# Altium project PCB_Project.PrjPcb
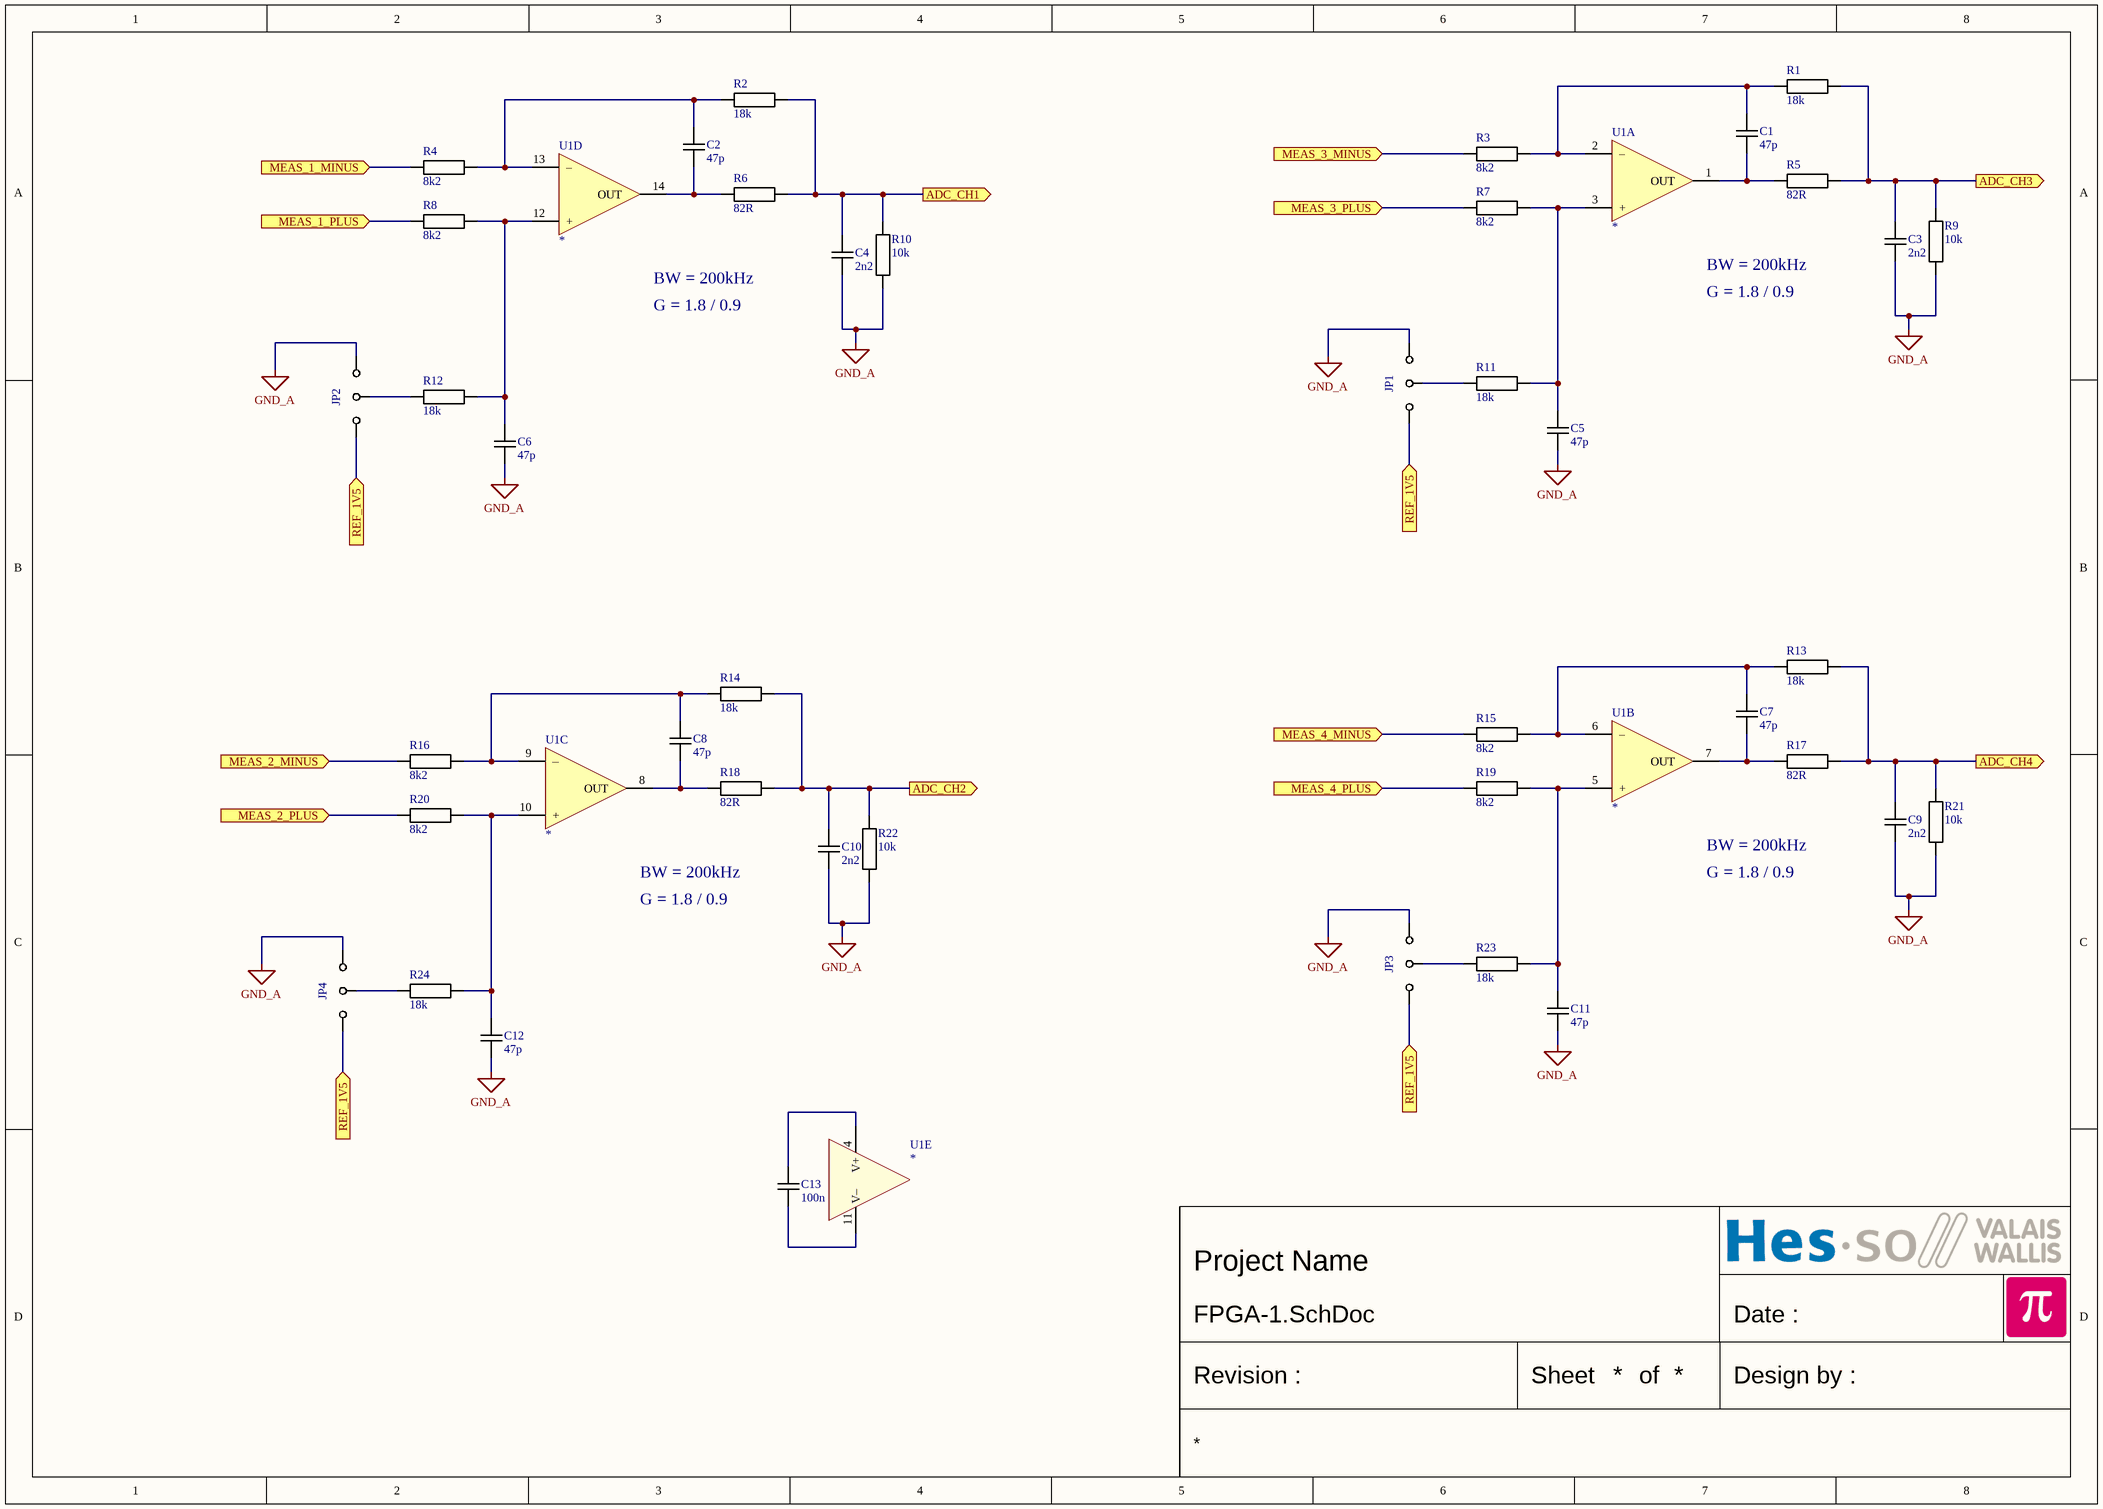
[diagram p0: FPGA-1.SchDoc]
7 sheets, 224 parts. Net scope: flat (ports and power ports of the same name join across sheets).
Board file: PCB-FPGA.PcbDoc
Sheets:
  FPGA-1.SchDoc
  FPGA.SchDoc
  FPGA-8.SchDoc
  FPGA-2.SchDoc
  FPGA-3.SchDoc
  FPGA-7.SchDoc
  FPGA-Supply.SchDoc

## Sheet FPGA-1.SchDoc
size A3; Date: Date; CompanyName: HESSO; Engineer: Name; Address1: Route du Rawyl 47; Address2: 1950 Sion; Address3: Switzerland; ProjectName: Project Name

### Parts
C1  47p  [CAPACITOR 1608 REFLOW]
C2  47p  [CAPACITOR 1608 REFLOW]
C3  2n2  [CAPACITOR 1608 REFLOW]
C4  2n2  [CAPACITOR 1608 REFLOW]
C5  47p  [CAPACITOR 1608 REFLOW]
C6  47p  [CAPACITOR 1608 REFLOW]
C7  47p  [CAPACITOR 1608 REFLOW]
C8  47p  [CAPACITOR 1608 REFLOW]
C9  2n2  [CAPACITOR 1608 REFLOW]
C10  2n2  [CAPACITOR 1608 REFLOW]
C11  47p  [CAPACITOR 1608 REFLOW]
C12  47p  [CAPACITOR 1608 REFLOW]
C13  100n  [CAPACITOR 1608 REFLOW]
JP1  {Value}  [JUMPER3 SMD 1608]  (value not drawn)
JP2  {Value}  [JUMPER3 SMD 1608]  (value not drawn)
JP3  {Value}  [JUMPER3 SMD 1608]  (value not drawn)
JP4  {Value}  [JUMPER3 SMD 1608]  (value not drawn)
R1  18k  [RESISTOR 1608 REFLOW]
R2  18k  [RESISTOR 1608 REFLOW]
R3  8k2  [RESISTOR 1608 REFLOW]
R4  8k2  [RESISTOR 1608 REFLOW]
R5  82R  [RESISTOR 1608 REFLOW]
R6  82R  [RESISTOR 1608 REFLOW]
R7  8k2  [RESISTOR 1608 REFLOW]
R8  8k2  [RESISTOR 1608 REFLOW]
R9  10k  [RESISTOR 1608 REFLOW]
R10  10k  [RESISTOR 1608 REFLOW]
R11  18k  [RESISTOR 1608 REFLOW]
R12  18k  [RESISTOR 1608 REFLOW]
R13  18k  [RESISTOR 1608 REFLOW]
R14  18k  [RESISTOR 1608 REFLOW]
R15  8k2  [RESISTOR 1608 REFLOW]
R16  8k2  [RESISTOR 1608 REFLOW]
R17  82R  [RESISTOR 1608 REFLOW]
R18  82R  [RESISTOR 1608 REFLOW]
R19  8k2  [RESISTOR 1608 REFLOW]
R20  8k2  [RESISTOR 1608 REFLOW]
R21  10k  [RESISTOR 1608 REFLOW]
R22  10k  [RESISTOR 1608 REFLOW]
R23  18k  [RESISTOR 1608 REFLOW]
R24  18k  [RESISTOR 1608 REFLOW]
U1  *  [SO14 P1.27 C4.0X8.8 H1.75]  (parts A,B,C,D,E of 5)

### Ports
ADC_CH1 (out), ADC_CH2 (out), ADC_CH3 (out), ADC_CH4 (out), MEAS_1_MINUS (in), MEAS_1_PLUS (in), MEAS_2_MINUS (in), MEAS_2_PLUS (in), MEAS_3_MINUS (in), MEAS_3_PLUS (in), MEAS_4_MINUS (in), MEAS_4_PLUS (in), REF_1V5 (in)

### Nets
GND_A: C3.1 C4.1 C5.1 C6.1 C9.1 C10.1 C11.1 C12.1 JP1.3 JP2.3 JP3.3 JP4.3 R9.2 R10.2 R21.2 R22.2
NetC1_1: C1.1 R5.1 U1.1(OUT)
NetC1_2: C1.2 R1.1 R3.2 U1.2(–)
NetC2_1: C2.1 R6.1 U1.14(OUT)
NetC2_2: C2.2 R2.1 R4.2 U1.13(–)
NetC3_2: C3.2 R1.2 R5.2 R9.1 ; port ADC_CH3
NetC4_2: C4.2 R2.2 R6.2 R10.1 ; port ADC_CH1
NetC5_2: C5.2 R7.2 R11.1 U1.3(+)
NetC6_2: C6.2 R8.2 R12.1 U1.12(+)
NetC7_1: C7.1 R17.1 U1.7(OUT)
NetC7_2: C7.2 R13.1 R15.2 U1.6(–)
NetC8_1: C8.1 R18.1 U1.8(OUT)
NetC8_2: C8.2 R14.1 R16.2 U1.9(–)
NetC9_2: C9.2 R13.2 R17.2 R21.1 ; port ADC_CH4
NetC10_2: C10.2 R14.2 R18.2 R22.1 ; port ADC_CH2
NetC11_2: C11.2 R19.2 R23.1 U1.5(+)
NetC12_2: C12.2 R20.2 R24.1 U1.10(+)
NetC13_1: C13.1 U1.11(V–)
NetC13_2: C13.2 U1.4(V+)
NetC106_2: JP1.1 JP2.1 JP3.1 JP4.1 ; port REF_1V5
NetJP1_2: JP1.2 R11.2
NetJP2_2: JP2.2 R12.2
NetJP3_2: JP3.2 R23.2
NetJP4_2: JP4.2 R24.2
NetR3_1: R3.1 ; port MEAS_3_MINUS
NetR4_1: R4.1 ; port MEAS_1_MINUS
NetR7_1: R7.1 ; port MEAS_3_PLUS
NetR8_1: R8.1 ; port MEAS_1_PLUS
NetR15_1: R15.1 ; port MEAS_4_MINUS
NetR16_1: R16.1 ; port MEAS_2_MINUS
NetR19_1: R19.1 ; port MEAS_4_PLUS
NetR20_1: R20.1 ; port MEAS_2_PLUS

### Notes on the sheet
- BW = 200kHz
- G = 1.8 / 0.9
- Date :
- Revision :
- Sheet
- of
- Design by :

### Library data of the parts
C1-C13 = Capacitor: Capacitor X7R 10% 50V 1608(0603)
  C1 C2 C5-C8 C11 C12: Value: 47p
  C3 C4 C9 C10: Value: 2n2
  C13: Value: 100n
JP1-JP4 = JUMPER 3 POS: Value: {Value}
R1-R24 = Resistor: Resistor 1% 50V 100mW 1608(0603)
  R1 R2 R11-R14 R23 R24: Value: 18k
  R3 R4 R7 R8 R15 R16 R19 R20: Value: 8k2
  R5 R6 R17 R18: Value: 82R
  R9 R10 R21 R22: Value: 10k
U1 = OPA QUAD: Generic quad OPA 14 pins; Value: *

## Sheet FPGA.SchDoc
size A2; Date: Date; CompanyName: HESSO; Engineer: Name; Address1: Route du Rawyl 47; Address2: 1950 Sion; Address3: Switzerland; ProjectName: Project Name
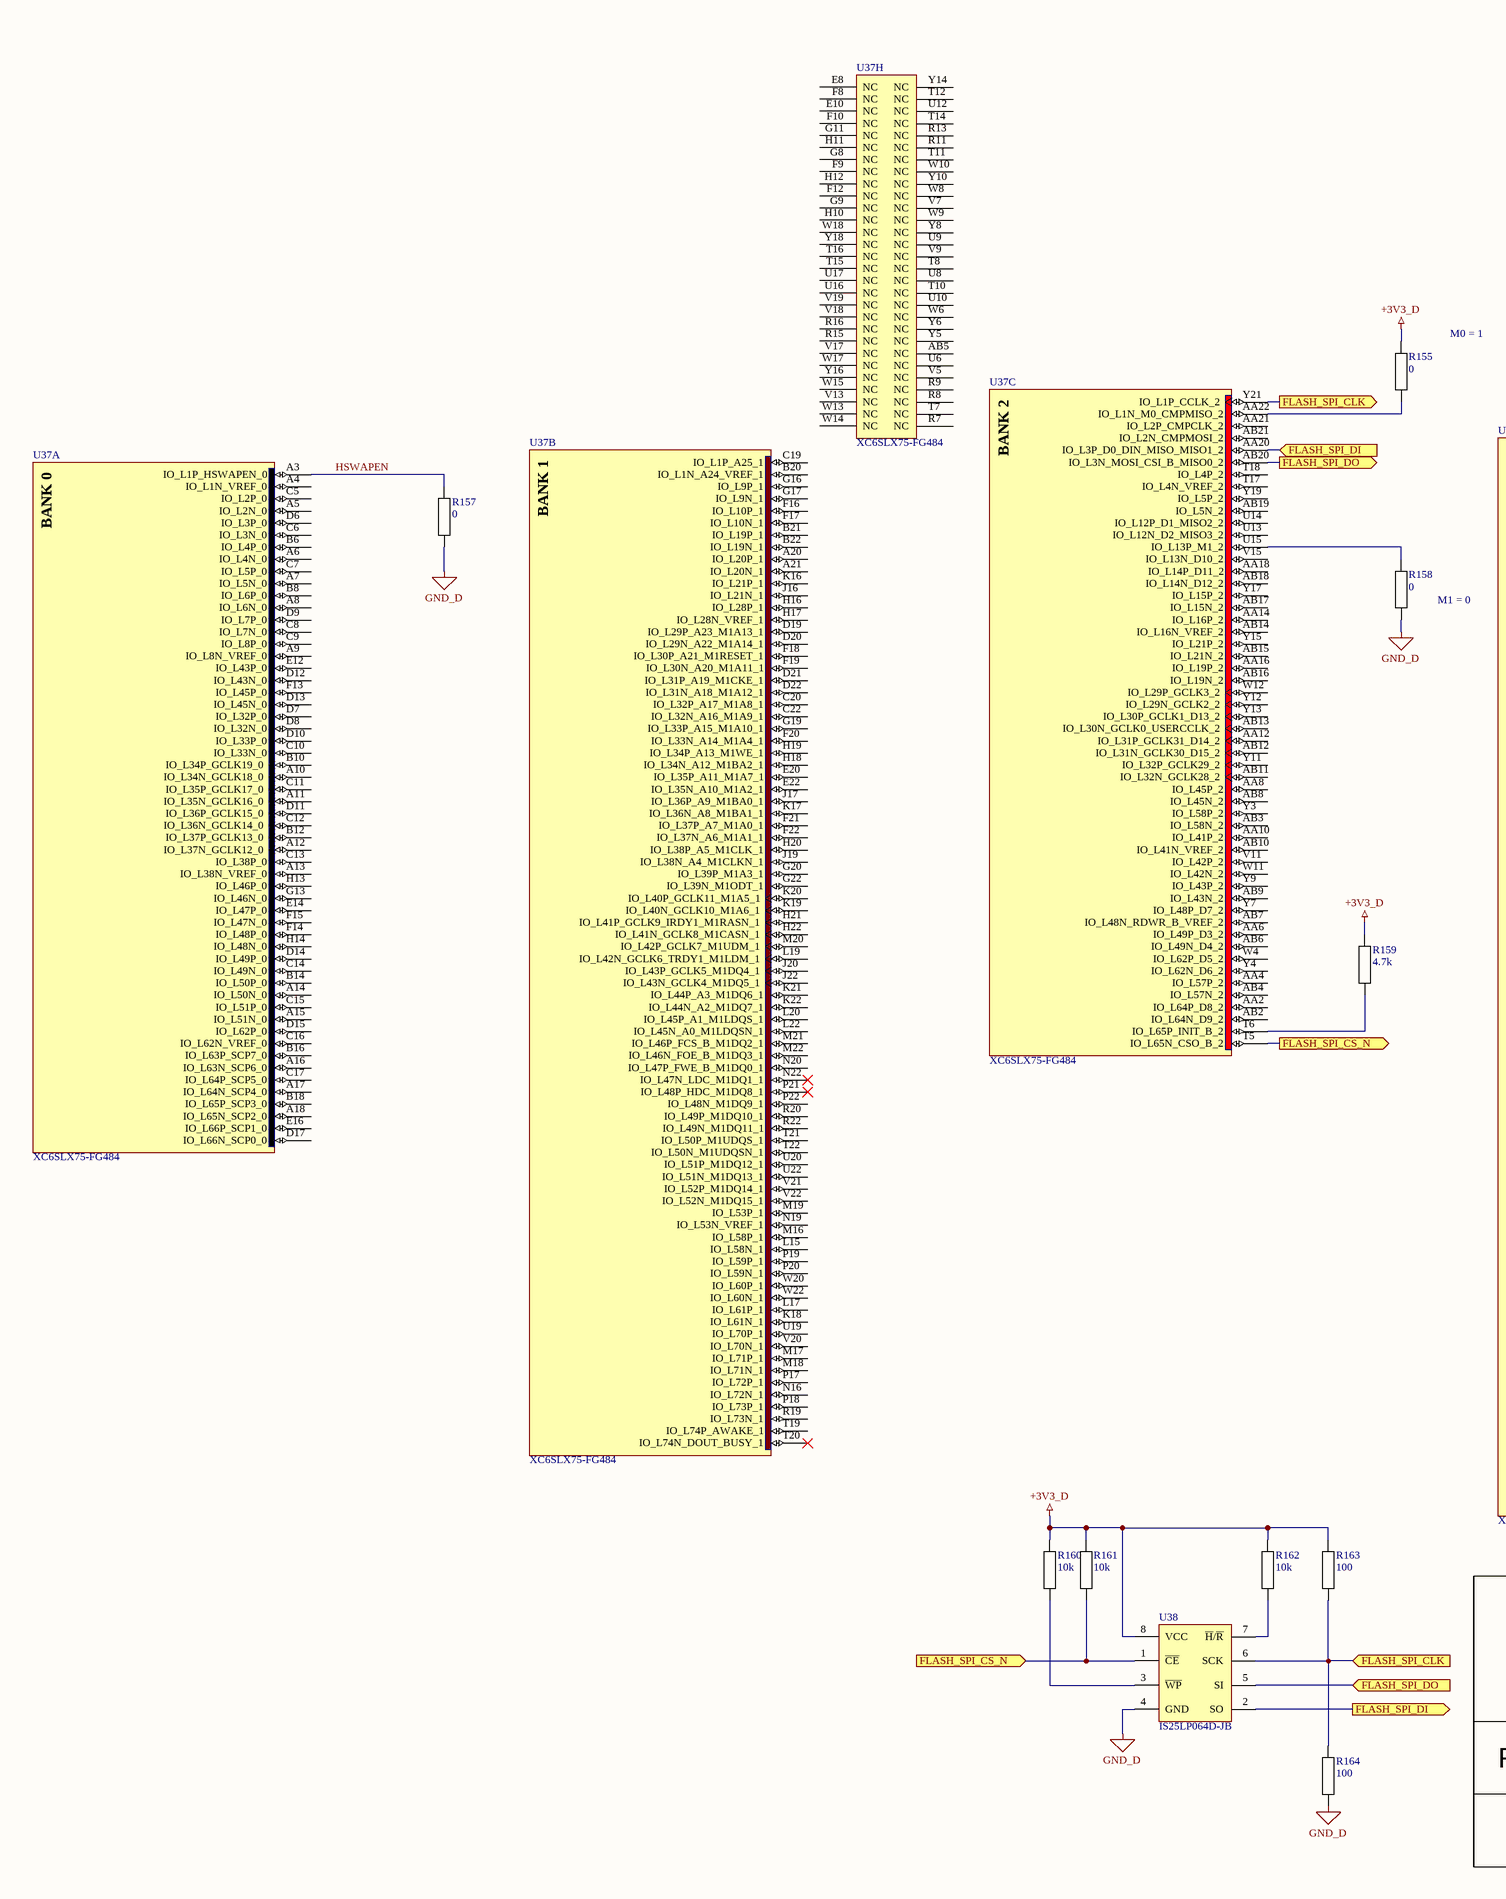
[diagram p1: FPGA.SchDoc, left]
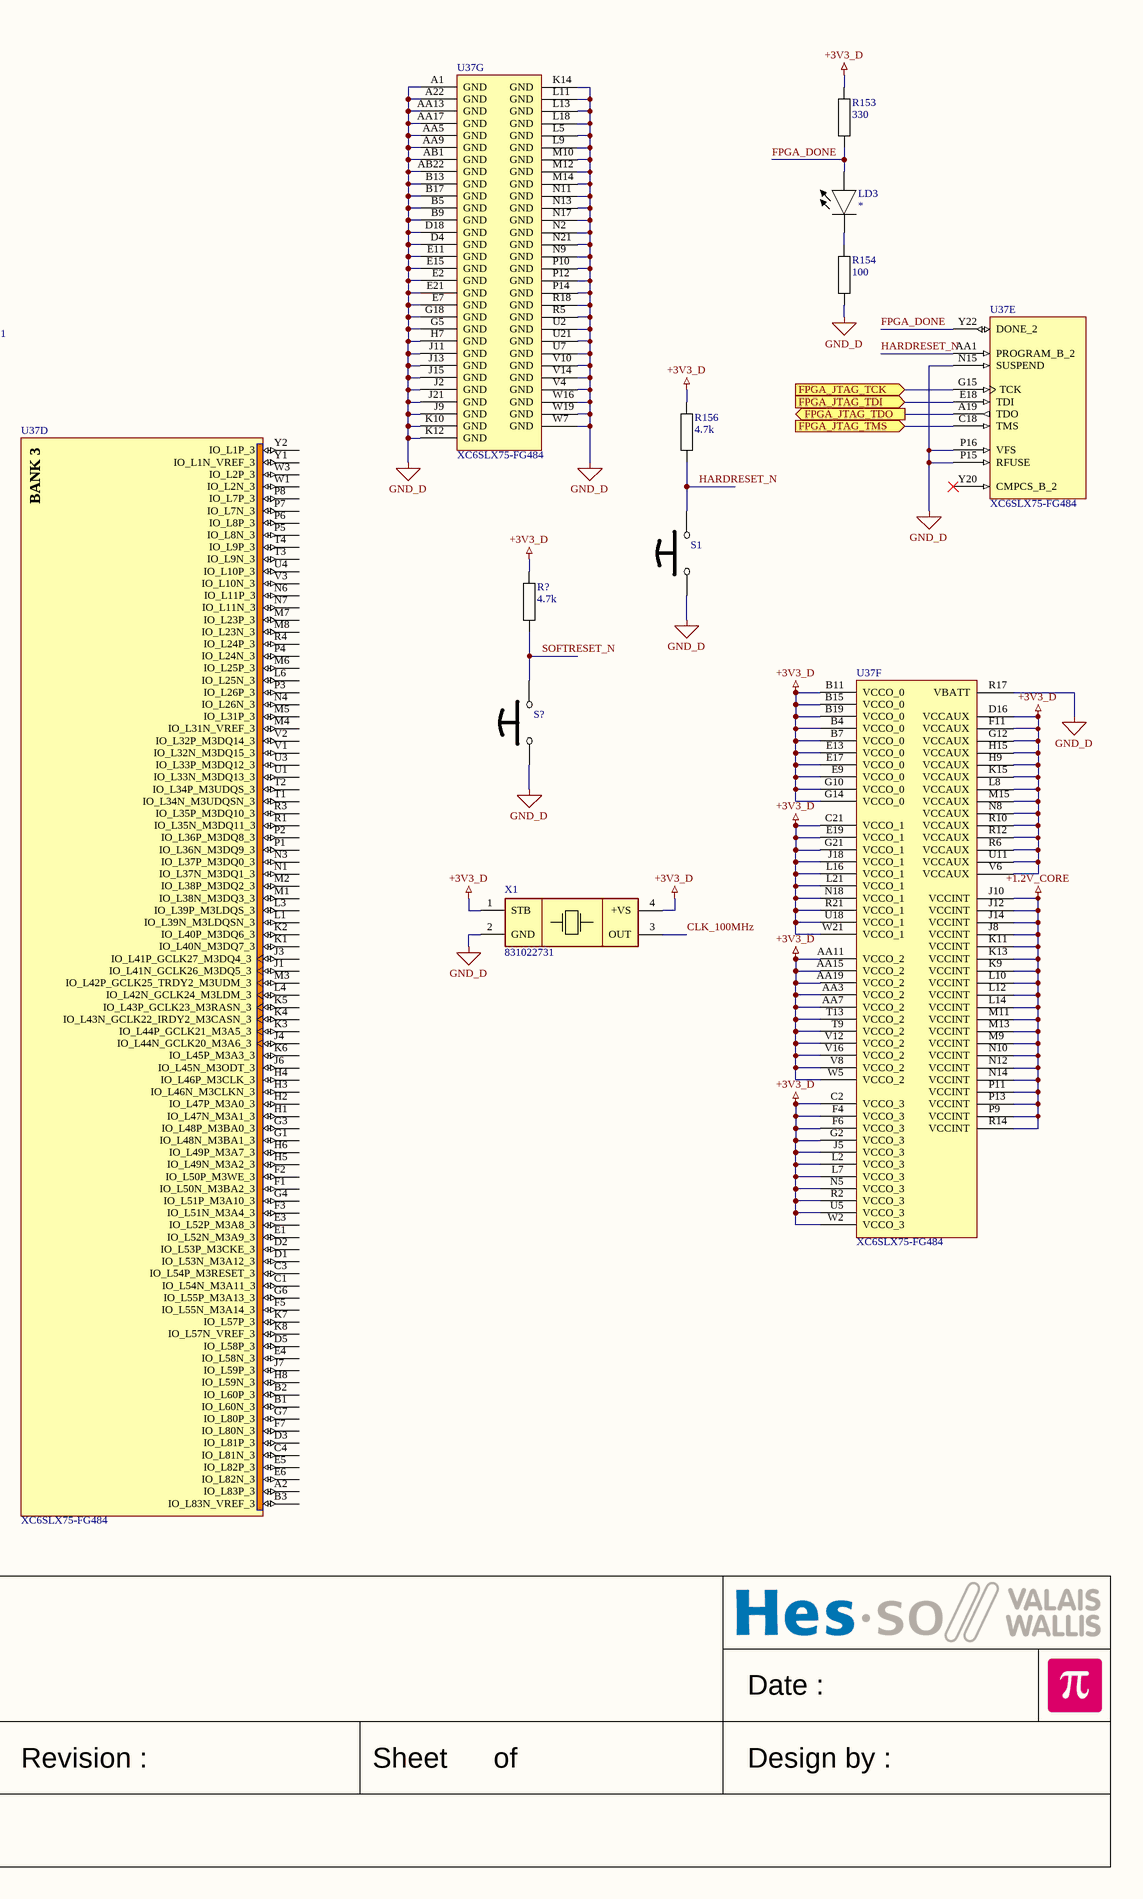
[diagram p2: FPGA.SchDoc, right]

### Parts
LD3  *  [LED 1608 REFLOW]
R153  330  [RESISTOR 2012 REFLOW]
R154  100  [RESISTOR 2012 REFLOW]
R155  0  [RESISTOR 2012 REFLOW]
R156  4.7k  [RESISTOR 2012 REFLOW]
R157  0  [RESISTOR 2012 REFLOW]
R158  0  [RESISTOR 2012 REFLOW]
R159  4.7k  [RESISTOR 2012 REFLOW]
R160  10k  [RESISTOR 1608 REFLOW]
R161  10k  [RESISTOR 1608 REFLOW]
R162  10k  [RESISTOR 1608 REFLOW]
R163  100  [RESISTOR 1608 REFLOW]
R164  100  [RESISTOR 1608 REFLOW]
R?  4.7k  [RESISTOR 2012 REFLOW]
S1  *  [Push Button C2.5X3.0 OMRON B3U-1000P(M)-B]  (value not drawn)
S?  *  [Push Button C2.5X3.0 OMRON B3U-1000P(M)-B]  (value not drawn)
U37  XC6SLX75-FG484  [BGA484 P1.0 C23X23 H2.2]  (parts A,B,C,D,E,F,G,H of 8)
U38  IS25LP064D-JB  [SO8 P1.27 C4.0X5.0 H1.75]
X1  831022731  [Oscillator C5.2x7.2 IQD LFSPXO]

### Ports
FLASH_SPI_CLK (in), FLASH_SPI_CLK (out), FLASH_SPI_CS_N (in), FLASH_SPI_CS_N (out), FLASH_SPI_DI (in), FLASH_SPI_DI (out), FLASH_SPI_DO (in), FLASH_SPI_DO (out), FPGA_JTAG_TCK (in), FPGA_JTAG_TDI (in), FPGA_JTAG_TDO (out), FPGA_JTAG_TMS (in)

### Nets
+1.2V_CORE: U37.J8(VCCINT) U37.J10(VCCINT) U37.J12(VCCINT) U37.J14(VCCINT) U37.K9(VCCINT) U37.K11(VCCINT) U37.K13(VCCINT) U37.L10(VCCINT) U37.L12(VCCINT) U37.L14(VCCINT) U37.M9(VCCINT) U37.M11(VCCINT) U37.M13(VCCINT) U37.N10(VCCINT) U37.N12(VCCINT) U37.N14(VCCINT) U37.P9(VCCINT) U37.P11(VCCINT) U37.P13(VCCINT) U37.R14(VCCINT)
+3V3_D: R153.2 R155.2 R156.2 R159.2 R160.2 R161.2 R162.2 R163.2 R?.2 U37.AA3(VCCO_2) U37.AA7(VCCO_2) U37.AA11(VCCO_2) U37.AA15(VCCO_2) U37.AA19(VCCO_2) U37.B4(VCCO_0) U37.B7(VCCO_0) U37.B11(VCCO_0) U37.B15(VCCO_0) U37.B19(VCCO_0) U37.C2(VCCO_3) U37.C21(VCCO_1) U37.D16(VCCAUX) U37.E9(VCCO_0) U37.E13(VCCO_0) U37.E17(VCCO_0) U37.E19(VCCO_1) U37.F4(VCCO_3) U37.F6(VCCO_3) U37.F11(VCCAUX) U37.G2(VCCO_3) U37.G10(VCCO_0) U37.G12(VCCAUX) U37.G14(VCCO_0) U37.G21(VCCO_1) U37.H9(VCCAUX) U37.H15(VCCAUX) U37.J5(VCCO_3) U37.J18(VCCO_1) U37.K15(VCCAUX) U37.L2(VCCO_3) U37.L7(VCCO_3) U37.L8(VCCAUX) U37.L16(VCCO_1) U37.L21(VCCO_1) U37.M15(VCCAUX) U37.N5(VCCO_3) U37.N8(VCCAUX) U37.N18(VCCO_1) U37.R2(VCCO_3) U37.R6(VCCAUX) U37.R10(VCCAUX) U37.R12(VCCAUX) U37.R21(VCCO_1) U37.T9(VCCO_2) U37.T13(VCCO_2) U37.U5(VCCO_3) U37.U11(VCCAUX) U37.U18(VCCO_1) U37.V6(VCCAUX) U37.V8(VCCO_2) U37.V12(VCCO_2) U37.V16(VCCO_2) U37.W2(VCCO_3) U37.W5(VCCO_2) U37.W21(VCCO_1) U38.8(VCC) X1.1(STB) X1.4(+VS)
GND_D: R154.1 R157.1 R158.1 R164.1 S1.1 S?.1 U37.A1(GND) U37.A22(GND) U37.AA5(GND) U37.AA9(GND) U37.AA13(GND) U37.AA17(GND) U37.AB1(GND) U37.AB22(GND) U37.B5(GND) U37.B9(GND) U37.B13(GND) U37.B17(GND) U37.D4(GND) U37.D18(GND) U37.E2(GND) U37.E7(GND) U37.E11(GND) U37.E15(GND) U37.E21(GND) U37.G5(GND) U37.G18(GND) U37.H7(GND) U37.J2(GND) U37.J9(GND) U37.J11(GND) U37.J13(GND) U37.J15(GND) U37.J21(GND) U37.K10(GND) U37.K12(GND) U37.K14(GND) U37.L5(GND) U37.L9(GND) U37.L11(GND) U37.L13(GND) U37.L18(GND) U37.M10(GND) U37.M12(GND) U37.M14(GND) U37.N2(GND) U37.N9(GND) U37.N11(GND) U37.N13(GND) U37.N15(SUSPEND) U37.N17(GND) U37.N21(GND) U37.P10(GND) U37.P12(GND) U37.P14(GND) U37.P15(RFUSE) U37.P16(VFS) U37.R5(GND) U37.R17(VBATT) U37.R18(GND) U37.U2(GND) U37.U7(GND) U37.U21(GND) U37.V4(GND) U37.V10(GND) U37.V14(GND) U37.W7(GND) U37.W16(GND) U37.W19(GND) U38.4(GND) X1.2(GND)
CLK_100MHz: X1.3(OUT)
FPGA_DONE: LD3.2(A) R153.1 U37.Y22(DONE_2)
HARDRESET_N: R156.1 S1.2 U37.AA1(PROGRAM_B_2)
HSWAPEN: R157.2 U37.A3(IO_L1P_HSWAPEN_0)
SOFTRESET_N: R?.1 S?.2
NetLD3_1: LD3.1(C) R154.2
NetR155_1: R155.1 U37.AA22(IO_L1N_M0_CMPMISO_2)
NetR158_2: R158.2 U37.U15(IO_L13P_M1_2)
NetR159_1: R159.1 U37.T6(IO_L65P_INIT_B_2)
NetR160_1: R160.1 U38.3(~{WP})
NetR161_1: R161.1 U37.T5(IO_L65N_CSO_B_2) U38.1(~{CE}) ; port FLASH_SPI_CS_N
NetR162_1: R162.1 U38.7(~{H}/~{R})
NetR163_1: R163.1 R164.2 U37.Y21(IO_L1P_CCLK_2) U38.6(SCK) ; port FLASH_SPI_CLK
NetU37_A19: U37.A19(TDO) ; port FPGA_JTAG_TDO
NetU37_AA20: U37.AA20(IO_L3P_D0_DIN_MISO_MISO1_2) U38.2(SO) ; port FLASH_SPI_DI
NetU37_AB20: U37.AB20(IO_L3N_MOSI_CSI_B_MISO0_2) U38.5(SI) ; port FLASH_SPI_DO
NetU37_C18: U37.C18(TMS) ; port FPGA_JTAG_TMS
NetU37_E18: U37.E18(TDI) ; port FPGA_JTAG_TDI
NetU37_G15: U37.G15(TCK) ; port FPGA_JTAG_TCK

Not connected (* = marked no-connect by the designer): U37 A2(IO_L83P_3) A4(IO_L1N_VREF_0) A5(IO_L2N_0) A6(IO_L4N_0) A7(IO_L5N_0) A8(IO_L6N_0) A9(IO_L8N_VREF_0) A10(IO_L34N_GCLK18_0) A11(IO_L35N_GCLK16_0) A12(IO_L37N_GCLK12_0) A13(IO_L38N_VREF_0) A14(IO_L50N_0) A15(IO_L51N_0) A16(IO_L63N_SCP6_0) A17(IO_L64N_SCP4_0) A18(IO_L65N_SCP2_0) A20(IO_L20P_1) A21(IO_L20N_1) AA2(IO_L64P_D8_2) AA4(IO_L57P_2) AA6(IO_L49P_D3_2) AA8(IO_L45P_2) AA10(IO_L41P_2) AA12(IO_L31P_GCLK31_D14_2) AA14(IO_L16P_2) AA16(IO_L19P_2) AA18(IO_L14P_D11_2) AA21(IO_L2P_CMPCLK_2) AB2(IO_L64N_D9_2) AB3(IO_L58N_2) AB4(IO_L57N_2) AB5(NC) AB6(IO_L49N_D4_2) AB7(IO_L48N_RDWR_B_VREF_2) AB8(IO_L45N_2) AB9(IO_L43N_2) AB10(IO_L41N_VREF_2) AB11(IO_L32N_GCLK28_2) AB12(IO_L31N_GCLK30_D15_2) AB13(IO_L30N_GCLK0_USERCCLK_2) AB14(IO_L16N_VREF_2) AB15(IO_L21N_2) AB16(IO_L19N_2) AB17(IO_L15N_2) AB18(IO_L14N_D12_2) AB19(IO_L5N_2) AB21(IO_L2N_CMPMOSI_2) B1(IO_L60N_3) B2(IO_L60P_3) B3(IO_L83N_VREF_3) B6(IO_L4P_0) B8(IO_L6P_0) B10(IO_L34P_GCLK19_0) B12(IO_L37P_GCLK13_0) B14(IO_L50P_0) B16(IO_L63P_SCP7_0) B18(IO_L65P_SCP3_0) B20(IO_L1N_A24_VREF_1) B21(IO_L19P_1) B22(IO_L19N_1) C1(IO_L54N_M3A11_3) C3(IO_L54P_M3RESET_3) C4(IO_L81N_3) C5(IO_L2P_0) C6(IO_L3N_0) C7(IO_L5P_0) C8(IO_L7N_0) C9(IO_L8P_0) C10(IO_L33N_0) C11(IO_L35P_GCLK17_0) C12(IO_L36N_GCLK14_0) C13(IO_L38P_0) C14(IO_L49N_0) C15(IO_L51P_0) C16(IO_L62N_VREF_0) C17(IO_L64P_SCP5_0) C19(IO_L1P_A25_1) C20(IO_L32P_A17_M1A8_1) C22(IO_L32N_A16_M1A9_1) D1(IO_L53N_M3A12_3) D2(IO_L53P_M3CKE_3) D3(IO_L81P_3) D5(IO_L58P_3) D6(IO_L3P_0) D7(IO_L32P_0) D8(IO_L32N_0) D9(IO_L7P_0) D10(IO_L33P_0) D11(IO_L36P_GCLK15_0) D12(IO_L43N_0) D13(IO_L45N_0) D14(IO_L49P_0) D15(IO_L62P_0) D17(IO_L66N_SCP0_0) D19(IO_L29P_A23_M1A13_1) D20(IO_L29N_A22_M1A14_1) D21(IO_L31P_A19_M1CKE_1) D22(IO_L31N_A18_M1A12_1) E1(IO_L52N_M3A9_3) E3(IO_L52P_M3A8_3) E4(IO_L58N_3) E5(IO_L82P_3) E6(IO_L82N_3) E8(NC) E10(NC) E12(IO_L43P_0) E14(IO_L47P_0) E16(IO_L66P_SCP1_0) E20(IO_L35P_A11_M1A7_1) E22(IO_L35N_A10_M1A2_1) F1(IO_L50N_M3BA2_3) F2(IO_L50P_M3WE_3) F3(IO_L51N_M3A4_3) F5(IO_L55N_M3A14_3) F7(IO_L80N_3) F8(NC) F9(NC) F10(NC) F12(NC) F13(IO_L45P_0) F14(IO_L48P_0) F15(IO_L47N_0) F16(IO_L10P_1) F17(IO_L10N_1) F18(IO_L30P_A21_M1RESET_1) F19(IO_L30N_A20_M1A11_1) F20(IO_L33N_A14_M1A4_1) F21(IO_L37P_A7_M1A0_1) F22(IO_L37N_A6_M1A1_1) G1(IO_L48N_M3BA1_3) G3(IO_L48P_M3BA0_3) G4(IO_L51P_M3A10_3) G6(IO_L55P_M3A13_3) G7(IO_L80P_3) G8(NC) G9(NC) G11(NC) G13(IO_L46N_0) G16(IO_L9P_1) G17(IO_L9N_1) G19(IO_L33P_A15_M1A10_1) G20(IO_L39P_M1A3_1) G22(IO_L39N_M1ODT_1) H1(IO_L47N_M3A1_3) H2(IO_L47P_M3A0_3) H3(IO_L46N_M3CLKN_3) H4(IO_L46P_M3CLK_3) H5(IO_L49N_M3A2_3) H6(IO_L49P_M3A7_3) H8(IO_L59N_3) H10(NC) H11(NC) H12(NC) H13(IO_L46P_0) H14(IO_L48N_0) H16(IO_L28P_1) H17(IO_L28N_VREF_1) H18(IO_L34N_A12_M1BA2_1) H19(IO_L34P_A13_M1WE_1) H20(IO_L38P_A5_M1CLK_1) H21(IO_L41P_GCLK9_IRDY1_M1RASN_1) H22(IO_L41N_GCLK8_M1CASN_1) J1(IO_L41N_GCLK26_M3DQ5_3) J3(IO_L41P_GCLK27_M3DQ4_3) J4(IO_L44N_GCLK20_M3A6_3) J6(IO_L45N_M3ODT_3) J7(IO_L59P_3) J16(IO_L21N_1) J17(IO_L36P_A9_M1BA0_1) J19(IO_L38N_A4_M1CLKN_1) J20(IO_L43P_GCLK5_M1DQ4_1) J22(IO_L43N_GCLK4_M1DQ5_1) K1(IO_L40N_M3DQ7_3) K2(IO_L40P_M3DQ6_3) K3(IO_L44P_GCLK21_M3A5_3) K4(IO_L43N_GCLK22_IRDY2_M3CASN_3) K5(IO_L43P_GCLK23_M3RASN_3) K6(IO_L45P_M3A3_3) K7(IO_L57P_3) K8(IO_L57N_VREF_3) K16(IO_L21P_1) K17(IO_L36N_A8_M1BA1_1) K18(IO_L61N_1) K19(IO_L40N_GCLK10_M1A6_1) K20(IO_L40P_GCLK11_M1A5_1) K21(IO_L44P_A3_M1DQ6_1) K22(IO_L44N_A2_M1DQ7_1) L1(IO_L39N_M3LDQSN_3) L3(IO_L39P_M3LDQS_3) L4(IO_L42N_GCLK24_M3LDM_3) L6(IO_L25N_3) L15(IO_L58N_1) L17(IO_L61P_1) L19(IO_L42N_GCLK6_TRDY1_M1LDM_1) L20(IO_L45P_A1_M1LDQS_1) L22(IO_L45N_A0_M1LDQSN_1) M1(IO_L38N_M3DQ3_3) M2(IO_L38P_M3DQ2_3) M3(IO_L42P_GCLK25_TRDY2_M3UDM_3) M4(IO_L31N_VREF_3) M5(IO_L31P_3) M6(IO_L25P_3) M7(IO_L23P_3) M8(IO_L23N_3) M16(IO_L58P_1) M17(IO_L71P_1) M18(IO_L71N_1) M19(IO_L53P_1) M20(IO_L42P_GCLK7_M1UDM_1) M21(IO_L46P_FCS_B_M1DQ2_1) M22(IO_L46N_FOE_B_M1DQ3_1) N1(IO_L37N_M3DQ1_3) N3(IO_L37P_M3DQ0_3) N4(IO_L26N_3) N6(IO_L11P_3) N7(IO_L11N_3) N16(IO_L72N_1) N19(IO_L53N_VREF_1) N20(IO_L47P_FWE_B_M1DQ0_1) N22(IO_L47N_LDC_M1DQ1_1)* P1(IO_L36N_M3DQ9_3) P2(IO_L36P_M3DQ8_3) P3(IO_L26P_3) P4(IO_L24N_3) P5(IO_L8N_3) P6(IO_L8P_3) P7(IO_L7N_3) P8(IO_L7P_3) P17(IO_L72P_1) P18(IO_L73P_1) P19(IO_L59P_1) P20(IO_L59N_1) P21(IO_L48P_HDC_M1DQ8_1)* P22(IO_L48N_M1DQ9_1) R1(IO_L35N_M3DQ11_3) R3(IO_L35P_M3DQ10_3) R4(IO_L24P_3) R7(NC) R8(NC) R9(NC) R11(NC) R13(NC) R15(NC) R16(NC) R19(IO_L73N_1) R20(IO_L49P_M1DQ10_1) R22(IO_L49N_M1DQ11_1) T1(IO_L34N_M3UDQSN_3) T2(IO_L34P_M3UDQS_3) T3(IO_L9N_3) T4(IO_L9P_3) T7(NC) T8(NC) T10(NC) T11(NC) T12(NC) T14(NC) T15(NC) T16(NC) T17(IO_L4N_VREF_2) T18(IO_L4P_2) T19(IO_L74P_AWAKE_1) T20(IO_L74N_DOUT_BUSY_1)* T21(IO_L50P_M1UDQS_1) T22(IO_L50N_M1UDQSN_1) U1(IO_L33N_M3DQ13_3) U3(IO_L33P_M3DQ12_3) U4(IO_L10P_3) U6(NC) U8(NC) U9(NC) U10(NC) U12(NC) U13(IO_L12N_D2_MISO3_2) U14(IO_L12P_D1_MISO2_2) U16(NC) U17(NC) U19(IO_L70P_1) U20(IO_L51P_M1DQ12_1) U22(IO_L51N_M1DQ13_1) V1(IO_L32N_M3DQ15_3) V2(IO_L32P_M3DQ14_3) V3(IO_L10N_3) V5(NC) V7(NC) V9(NC) V11(IO_L42P_2) V13(NC) V15(IO_L13N_D10_2) V17(NC) V18(NC) V19(NC) V20(IO_L70N_1) V21(IO_L52P_M1DQ14_1) V22(IO_L52N_M1DQ15_1) W1(IO_L2N_3) W3(IO_L2P_3) W4(IO_L62P_D5_2) W6(NC) W8(NC) W9(NC) W10(NC) W11(IO_L42N_2) W12(IO_L29P_GCLK3_2) W13(NC) W14(NC) W15(NC) W17(NC) W18(NC) W20(IO_L60P_1) W22(IO_L60N_1) Y1(IO_L1N_VREF_3) Y2(IO_L1P_3) Y3(IO_L58P_2) Y4(IO_L62N_D6_2) Y5(NC) Y6(NC) Y7(IO_L48P_D7_2) Y8(NC) Y9(IO_L43P_2) Y10(NC) Y11(IO_L32P_GCLK29_2) Y12(IO_L29N_GCLK2_2) Y13(IO_L30P_GCLK1_D13_2) Y14(NC) Y15(IO_L21P_2) Y16(NC) Y17(IO_L15P_2) Y18(NC) Y19(IO_L5P_2) Y20(CMPCS_B_2)*

### Notes on the sheet
- M0 = 1
- (near R158) M1 = 0
- Date :
- Revision :
- Sheet
- of
- Design by :
- (in symbol XC6SLX75-FG484, part A) BANK 0
- (in symbol XC6SLX75-FG484, part B) BANK 1
- (in symbol XC6SLX75-FG484, part C) BANK 2
- (in symbol XC6SLX75-FG484, part D) BANK 3

### Library data of the parts
LD3 = LED: LED generic; Value: *
R153-R159 R? = Resistor: Resistor 1% 50V 125mW 2012(0805)
  R153: Value: 330
  R154: Value: 100
  R155 R157 R158: Value: 0
  R156 R159 R?: Value: 4.7k
R160-R164 = Resistor: Resistor 1% 50V 100mW 1608(0603)
  R160-R162: Value: 10k
  R163 R164: Value: 100
S1 S? = Push Button 2Pins: Push Button, 2 pins; Value: *
U37 = XC6SLX75-FG484: Spartan-6 LXT 1.2V FPGA, 268 User I/Os, 484-Ball Fine-Pitch BGA (1.0mm Pitch); Value: XC6SLX75-FG484
U38 = IS25LP064D-JB: 64Mb Serial Flash Memory; Value: IS25LP064D-JB
X1 = Oscillator C5.2x7.2 IQD LFSPXO: Value: 831022731; MouserNumber: 710-831022731

## Sheet FPGA-8.SchDoc
size A3; Date: Date; CompanyName: HESSO; Engineer: Name; Address1: Route du Rawyl 47; Address2: 1950 Sion; Address3: Switzerland; ProjectName: Project Name
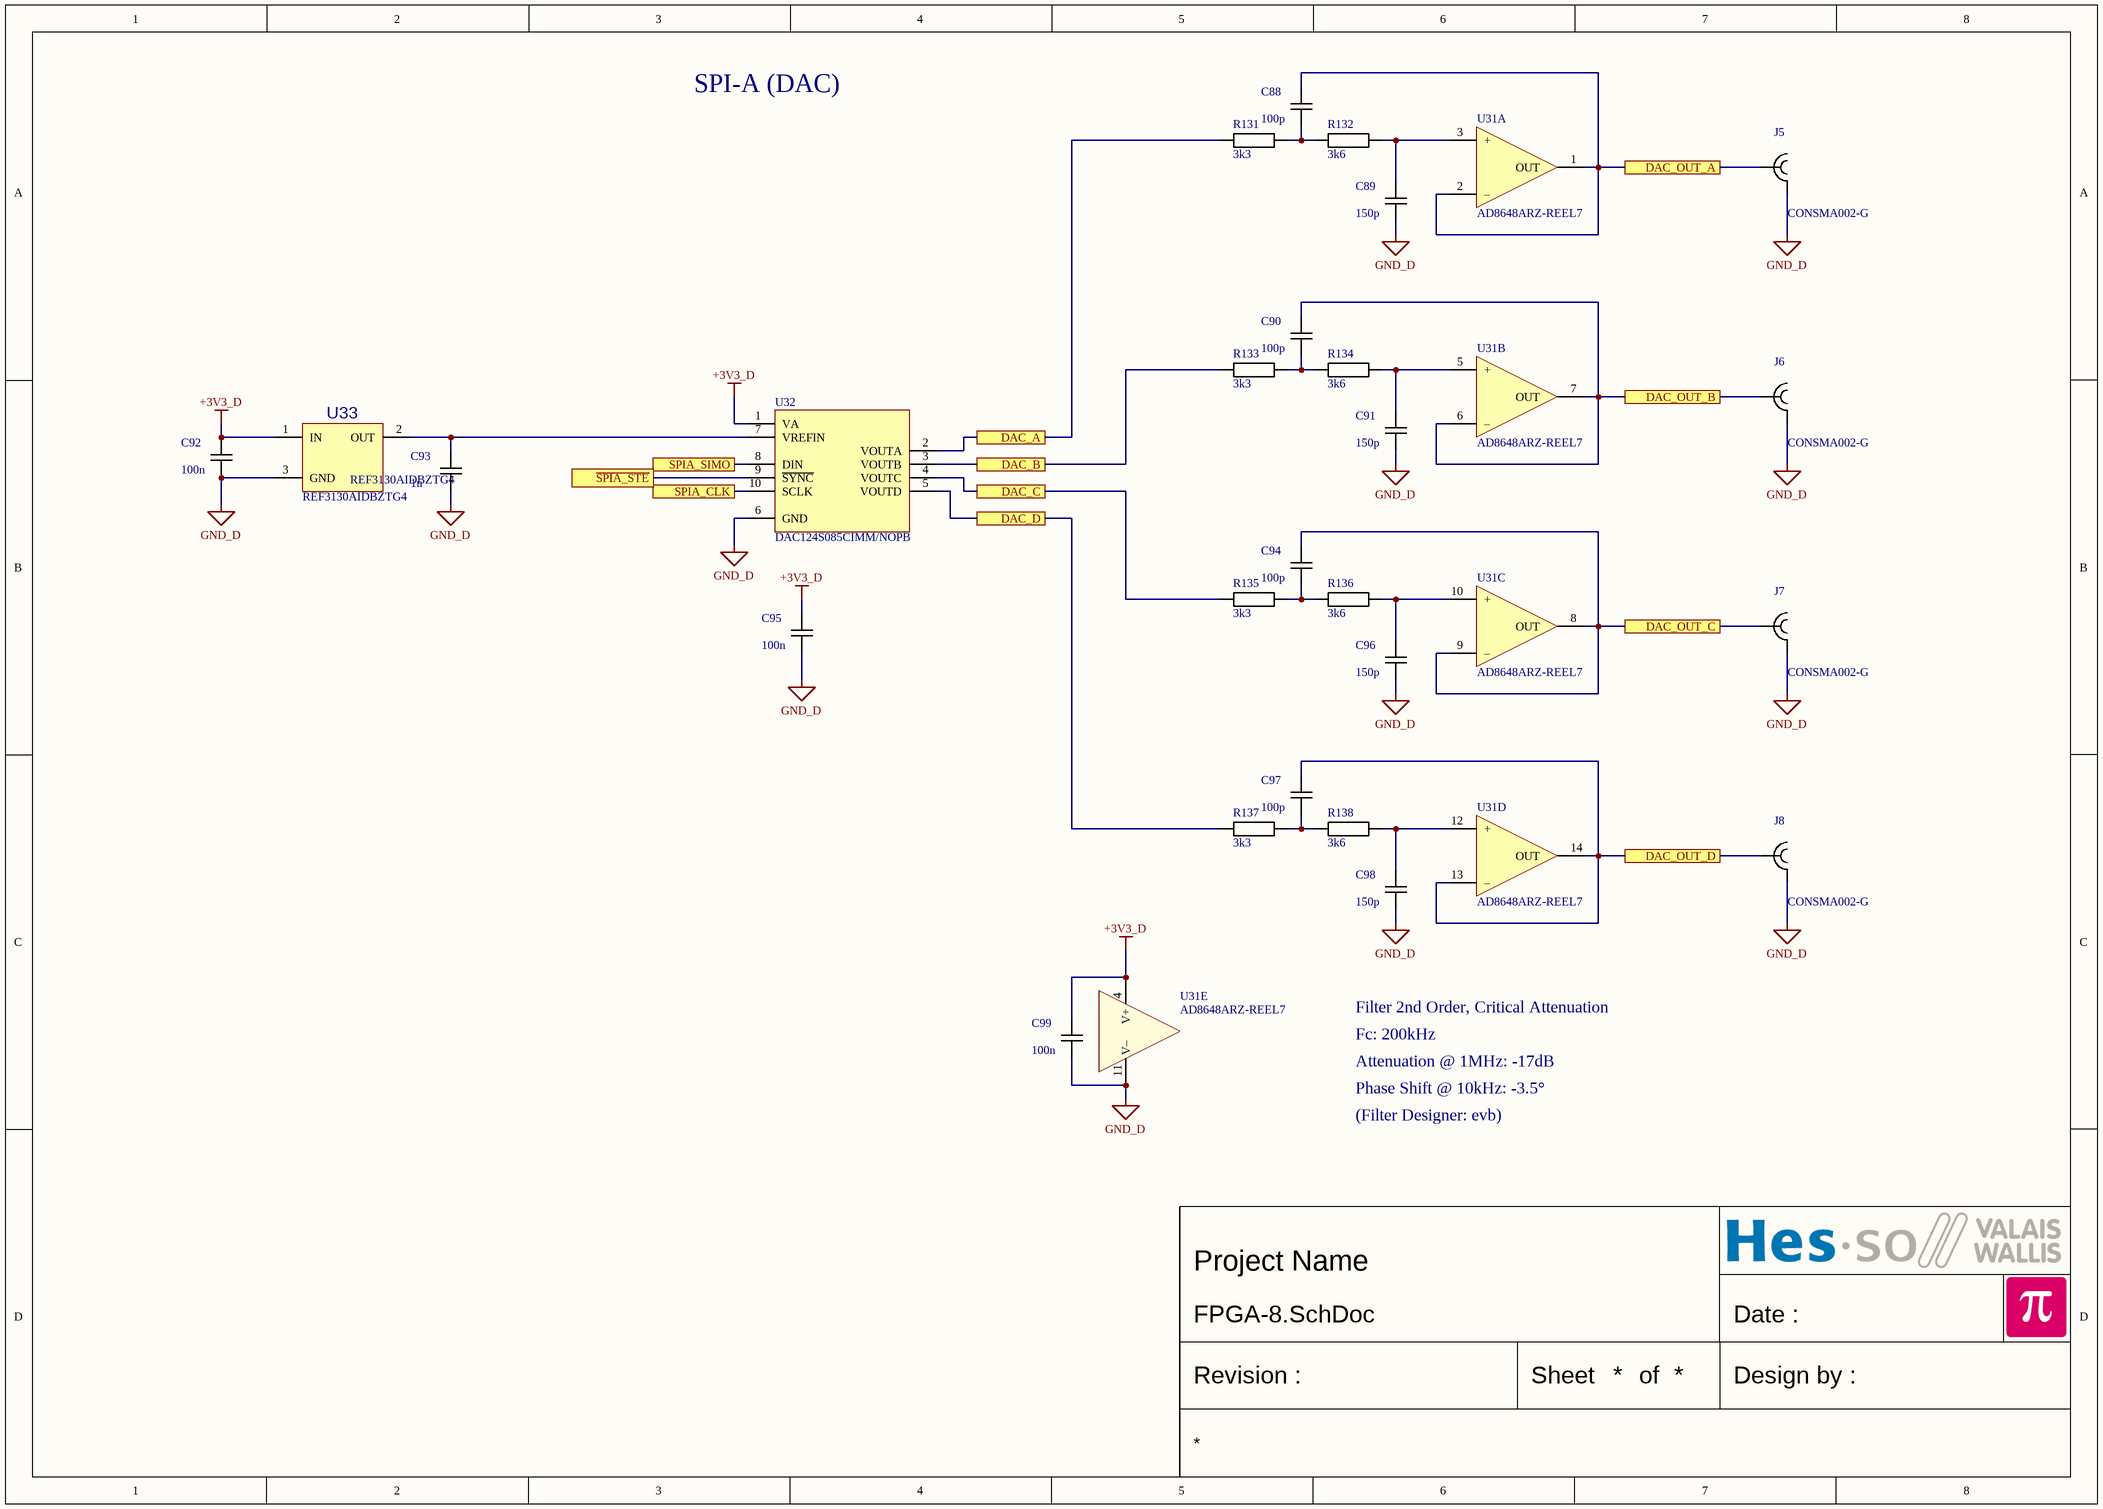
[diagram p3: FPGA-8.SchDoc]

### Parts
C88  100p  [CAPACITOR 2012 REFLOW]
C89  150p  [CAPACITOR 2012 REFLOW]
C90  100p  [CAPACITOR 2012 REFLOW]
C91  150p  [CAPACITOR 2012 REFLOW]
C92  100n  [CAPACITOR 2012 REFLOW]
C93  1u  [CAPACITOR 2012 REFLOW]
C94  100p  [CAPACITOR 2012 REFLOW]
C95  100n  [CAPACITOR 1608 REFLOW]
C96  150p  [CAPACITOR 2012 REFLOW]
C97  100p  [CAPACITOR 2012 REFLOW]
C98  150p  [CAPACITOR 2012 REFLOW]
C99  100n  [CAPACITOR 1608 REFLOW]
J5  CONSMA002-G  [SMA TH Right Angle Linx CONSMA002]
J6  CONSMA002-G  [SMA TH Right Angle Linx CONSMA002]
J7  CONSMA002-G  [SMA TH Right Angle Linx CONSMA002]
J8  CONSMA002-G  [SMA TH Right Angle Linx CONSMA002]
R131  3k3  [RESISTOR 2012 REFLOW]
R132  3k6  [RESISTOR 2012 REFLOW]
R133  3k3  [RESISTOR 2012 REFLOW]
R134  3k6  [RESISTOR 2012 REFLOW]
R135  3k3  [RESISTOR 2012 REFLOW]
R136  3k6  [RESISTOR 2012 REFLOW]
R137  3k3  [RESISTOR 2012 REFLOW]
R138  3k6  [RESISTOR 2012 REFLOW]
U31  AD8648ARZ-REEL7  [SO14 P1.27 C4.0X8.8 H1.75]  (parts A,B,C,D,E of 5)
U32  DAC124S085CIMM/NOPB  [VSSOP10 P0.5 C3.1X3.1 H1.1]
U33  REF3130AIDBZTG4  [SOT23 P0.95 C1.6x3.0 H1.3]

### Ports
DAC_A, DAC_B, DAC_C, DAC_D, DAC_OUT_A, DAC_OUT_B, DAC_OUT_C, DAC_OUT_D, SPIA_CLK, SPIA_SIMO, ~{SPIA_STE}

### Nets
+3V3_D: C92.2 C95.2 C99.2 U31.4(V+) U32.1(VA) U33.1(IN)
GND_D: C89.1 C91.1 C92.1 C93.1 C95.1 C96.1 C98.1 C99.1 J5.2 J6.2 J7.2 J8.2 U31.11(V–) U32.6(GND) U33.3(GND)
NetC76_2: C88.2 J5.1 U31.1(OUT) U31.2(–) ; port DAC_OUT_A
NetC78_2: C90.2 J6.1 U31.6(–) U31.7(OUT) ; port DAC_OUT_B
NetC82_2: C94.2 J7.1 U31.8(OUT) U31.9(–) ; port DAC_OUT_C
NetC85_2: C97.2 J8.1 U31.13(–) U31.14(OUT) ; port DAC_OUT_D
NetC88_1: C88.1 R131.2 R132.1
NetC89_2: C89.2 R132.2 U31.3(+)
NetC90_1: C90.1 R133.2 R134.1
NetC91_2: C91.2 R134.2 U31.5(+)
NetC93_2: C93.2 U32.7(VREFIN) U33.2(OUT)
NetC94_1: C94.1 R135.2 R136.1
NetC96_2: C96.2 R136.2 U31.10(+)
NetC97_1: C97.1 R137.2 R138.1
NetC98_2: C98.2 R138.2 U31.12(+)
NetR123_1: R131.1 U32.2(VOUTA) ; port DAC_A
NetR125_1: R133.1 U32.3(VOUTB) ; port DAC_B
NetR127_1: R135.1 U32.4(VOUTC) ; port DAC_C
NetR129_1: R137.1 U32.5(VOUTD) ; port DAC_D
NetU29_8: U32.8(DIN) ; port SPIA_SIMO
NetU29_9: U32.9(~{SYNC}) ; port ~{SPIA_STE}
NetU29_10: U32.10(SCLK) ; port SPIA_CLK

### Notes on the sheet
- SPI-A (DAC)
- Filter 2nd Order, Critical Attenuation
- Fc: 200kHz
- Attenuation @ 1MHz: -17dB
- Phase Shift @ 10kHz: -3.5°
- (Filter Designer: evb)
- Date :
- Revision :
- Sheet
- of
- Design by :

### Library data of the parts
C88-C92 C94 C96-C98 = Capacitor: Capacitor X7R 10% 50V 2012(0805)
  C88 C90 C94 C97: Value: 100p
  C89 C91 C96 C98: Value: 150p
  C92: Value: 100n
C93 = Capacitor: Capacitor X7R 10% 10V 2012(0805); Value: 1u
C95 C99 = Capacitor: Capacitor X7R 10% 50V 1608(0603); Value: 100n
J5-J8 = SMA TH RIGHT ANGLE LINX CONSMA002: Manufacturer: Linx Technologies; Value: CONSMA002-G; Mouser No.: 712-CONSMA002-G
R131-R138 = Resistor: Resistor 1% 50V 125mW 2012(0805)
  R131 R133 R135 R137: Value: 3k3
  R132 R134 R136 R138: Value: 3k6
U31 = OPA QUAD: Generic quad OPA 14 pins; Manufacturer: Analog Devices; Value: AD8648ARZ-REEL7; Mouser No.: 584-AD8648ARZ-R7
U32 = DAC124S085CIMM: DAC124S085 12-Bit Micro Power Quad Digital-to-Analog Converter With Rail-to-Rail Output; Manufacturer: Texas Instruments; Value: DAC124S085CIMM/NOPB; Mouser No.: 926-DAC124S085CIMMNO
U33 = REFERENCE SOT23 IN-OUT- GND: Generic Positive Voltage Reference; Manufacturer: Texas Instruments; Value: REF3130AIDBZTG4; Mouser No.: 595-REF3130AIDBZTG4

## Sheet FPGA-2.SchDoc
size A3; Date: Date; CompanyName: HESSO; Engineer: Name; Address1: Route du Rawyl 47; Address2: 1950 Sion; Address3: Switzerland; ProjectName: Project Name
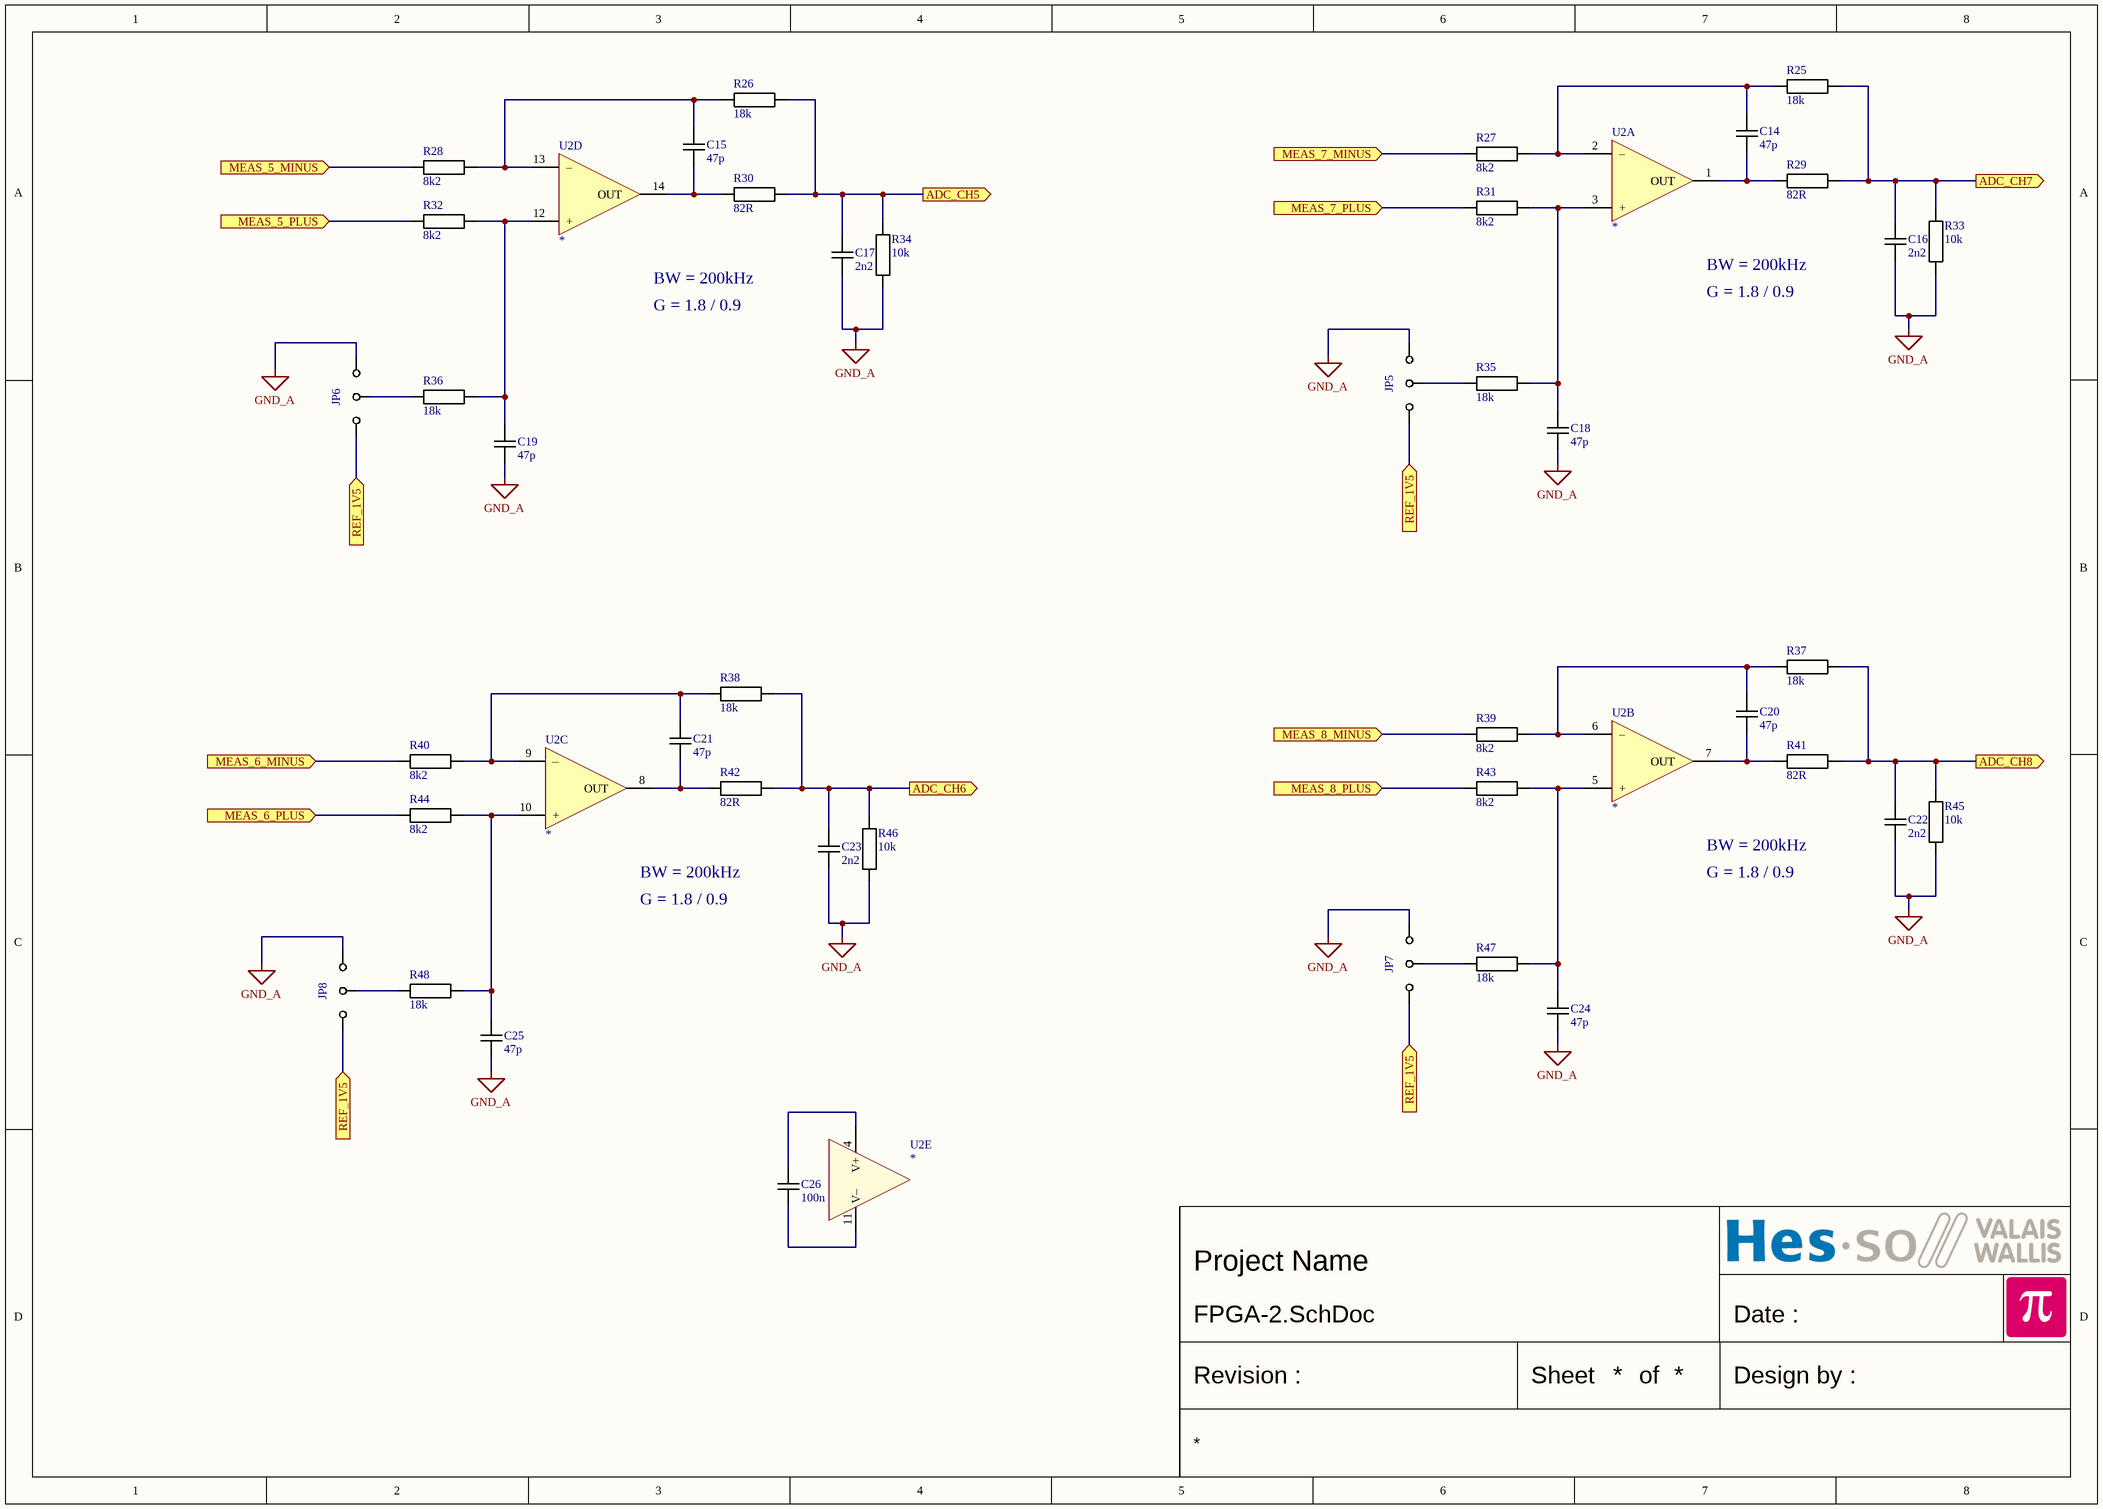
[diagram p4: FPGA-2.SchDoc]

### Parts
C14  47p  [CAPACITOR 1608 REFLOW]
C15  47p  [CAPACITOR 1608 REFLOW]
C16  2n2  [CAPACITOR 1608 REFLOW]
C17  2n2  [CAPACITOR 1608 REFLOW]
C18  47p  [CAPACITOR 1608 REFLOW]
C19  47p  [CAPACITOR 1608 REFLOW]
C20  47p  [CAPACITOR 1608 REFLOW]
C21  47p  [CAPACITOR 1608 REFLOW]
C22  2n2  [CAPACITOR 1608 REFLOW]
C23  2n2  [CAPACITOR 1608 REFLOW]
C24  47p  [CAPACITOR 1608 REFLOW]
C25  47p  [CAPACITOR 1608 REFLOW]
C26  100n  [CAPACITOR 1608 REFLOW]
JP5  {Value}  [JUMPER3 SMD 1608]  (value not drawn)
JP6  {Value}  [JUMPER3 SMD 1608]  (value not drawn)
JP7  {Value}  [JUMPER3 SMD 1608]  (value not drawn)
JP8  {Value}  [JUMPER3 SMD 1608]  (value not drawn)
R25  18k  [RESISTOR 1608 REFLOW]
R26  18k  [RESISTOR 1608 REFLOW]
R27  8k2  [RESISTOR 1608 REFLOW]
R28  8k2  [RESISTOR 1608 REFLOW]
R29  82R  [RESISTOR 1608 REFLOW]
R30  82R  [RESISTOR 1608 REFLOW]
R31  8k2  [RESISTOR 1608 REFLOW]
R32  8k2  [RESISTOR 1608 REFLOW]
R33  10k  [RESISTOR 1608 REFLOW]
R34  10k  [RESISTOR 1608 REFLOW]
R35  18k  [RESISTOR 1608 REFLOW]
R36  18k  [RESISTOR 1608 REFLOW]
R37  18k  [RESISTOR 1608 REFLOW]
R38  18k  [RESISTOR 1608 REFLOW]
R39  8k2  [RESISTOR 1608 REFLOW]
R40  8k2  [RESISTOR 1608 REFLOW]
R41  82R  [RESISTOR 1608 REFLOW]
R42  82R  [RESISTOR 1608 REFLOW]
R43  8k2  [RESISTOR 1608 REFLOW]
R44  8k2  [RESISTOR 1608 REFLOW]
R45  10k  [RESISTOR 1608 REFLOW]
R46  10k  [RESISTOR 1608 REFLOW]
R47  18k  [RESISTOR 1608 REFLOW]
R48  18k  [RESISTOR 1608 REFLOW]
U2  *  [SO14 P1.27 C4.0X8.8 H1.75]  (parts A,B,C,D,E of 5)

### Ports
ADC_CH5 (out), ADC_CH6 (out), ADC_CH7 (out), ADC_CH8 (out), MEAS_5_MINUS (in), MEAS_5_PLUS (in), MEAS_6_MINUS (in), MEAS_6_PLUS (in), MEAS_7_MINUS (in), MEAS_7_PLUS (in), MEAS_8_MINUS (in), MEAS_8_PLUS (in), REF_1V5 (in)

### Nets
GND_A: C16.1 C17.1 C18.1 C19.1 C22.1 C23.1 C24.1 C25.1 JP5.3 JP6.3 JP7.3 JP8.3 R33.2 R34.2 R45.2 R46.2
NetC14_1: C14.1 R29.1 U2.1(OUT)
NetC14_2: C14.2 R25.1 R27.2 U2.2(–)
NetC15_1: C15.1 R30.1 U2.14(OUT)
NetC15_2: C15.2 R26.1 R28.2 U2.13(–)
NetC16_2: C16.2 R25.2 R29.2 R33.1 ; port ADC_CH7
NetC17_2: C17.2 R26.2 R30.2 R34.1 ; port ADC_CH5
NetC18_2: C18.2 R31.2 R35.1 U2.3(+)
NetC19_2: C19.2 R32.2 R36.1 U2.12(+)
NetC20_1: C20.1 R41.1 U2.7(OUT)
NetC20_2: C20.2 R37.1 R39.2 U2.6(–)
NetC21_1: C21.1 R42.1 U2.8(OUT)
NetC21_2: C21.2 R38.1 R40.2 U2.9(–)
NetC22_2: C22.2 R37.2 R41.2 R45.1 ; port ADC_CH8
NetC23_2: C23.2 R38.2 R42.2 R46.1 ; port ADC_CH6
NetC24_2: C24.2 R43.2 R47.1 U2.5(+)
NetC25_2: C25.2 R44.2 R48.1 U2.10(+)
NetC26_1: C26.1 U2.11(V–)
NetC26_2: C26.2 U2.4(V+)
NetC106_2: JP5.1 JP6.1 JP7.1 JP8.1 ; port REF_1V5
NetJP5_2: JP5.2 R35.2
NetJP6_2: JP6.2 R36.2
NetJP7_2: JP7.2 R47.2
NetJP8_2: JP8.2 R48.2
NetR27_1: R27.1 ; port MEAS_7_MINUS
NetR28_1: R28.1 ; port MEAS_5_MINUS
NetR31_1: R31.1 ; port MEAS_7_PLUS
NetR32_1: R32.1 ; port MEAS_5_PLUS
NetR39_1: R39.1 ; port MEAS_8_MINUS
NetR40_1: R40.1 ; port MEAS_6_MINUS
NetR43_1: R43.1 ; port MEAS_8_PLUS
NetR44_1: R44.1 ; port MEAS_6_PLUS

### Notes on the sheet
- BW = 200kHz
- G = 1.8 / 0.9
- Date :
- Revision :
- Sheet
- of
- Design by :

### Library data of the parts
C14-C26 = Capacitor: Capacitor X7R 10% 50V 1608(0603)
  C14 C15 C18-C21 C24 C25: Value: 47p
  C16 C17 C22 C23: Value: 2n2
  C26: Value: 100n
JP5-JP8 = JUMPER 3 POS: Value: {Value}
R25-R48 = Resistor: Resistor 1% 50V 100mW 1608(0603)
  R25 R26 R35-R38 R47 R48: Value: 18k
  R27 R28 R31 R32 R39 R40 R43 R44: Value: 8k2
  R29 R30 R41 R42: Value: 82R
  R33 R34 R45 R46: Value: 10k
U2 = OPA QUAD: Generic quad OPA 14 pins; Value: *

## Sheet FPGA-3.SchDoc
size A3; Date: Date; CompanyName: HESSO; Engineer: Name; Address1: Route du Rawyl 47; Address2: 1950 Sion; Address3: Switzerland; ProjectName: Project Name
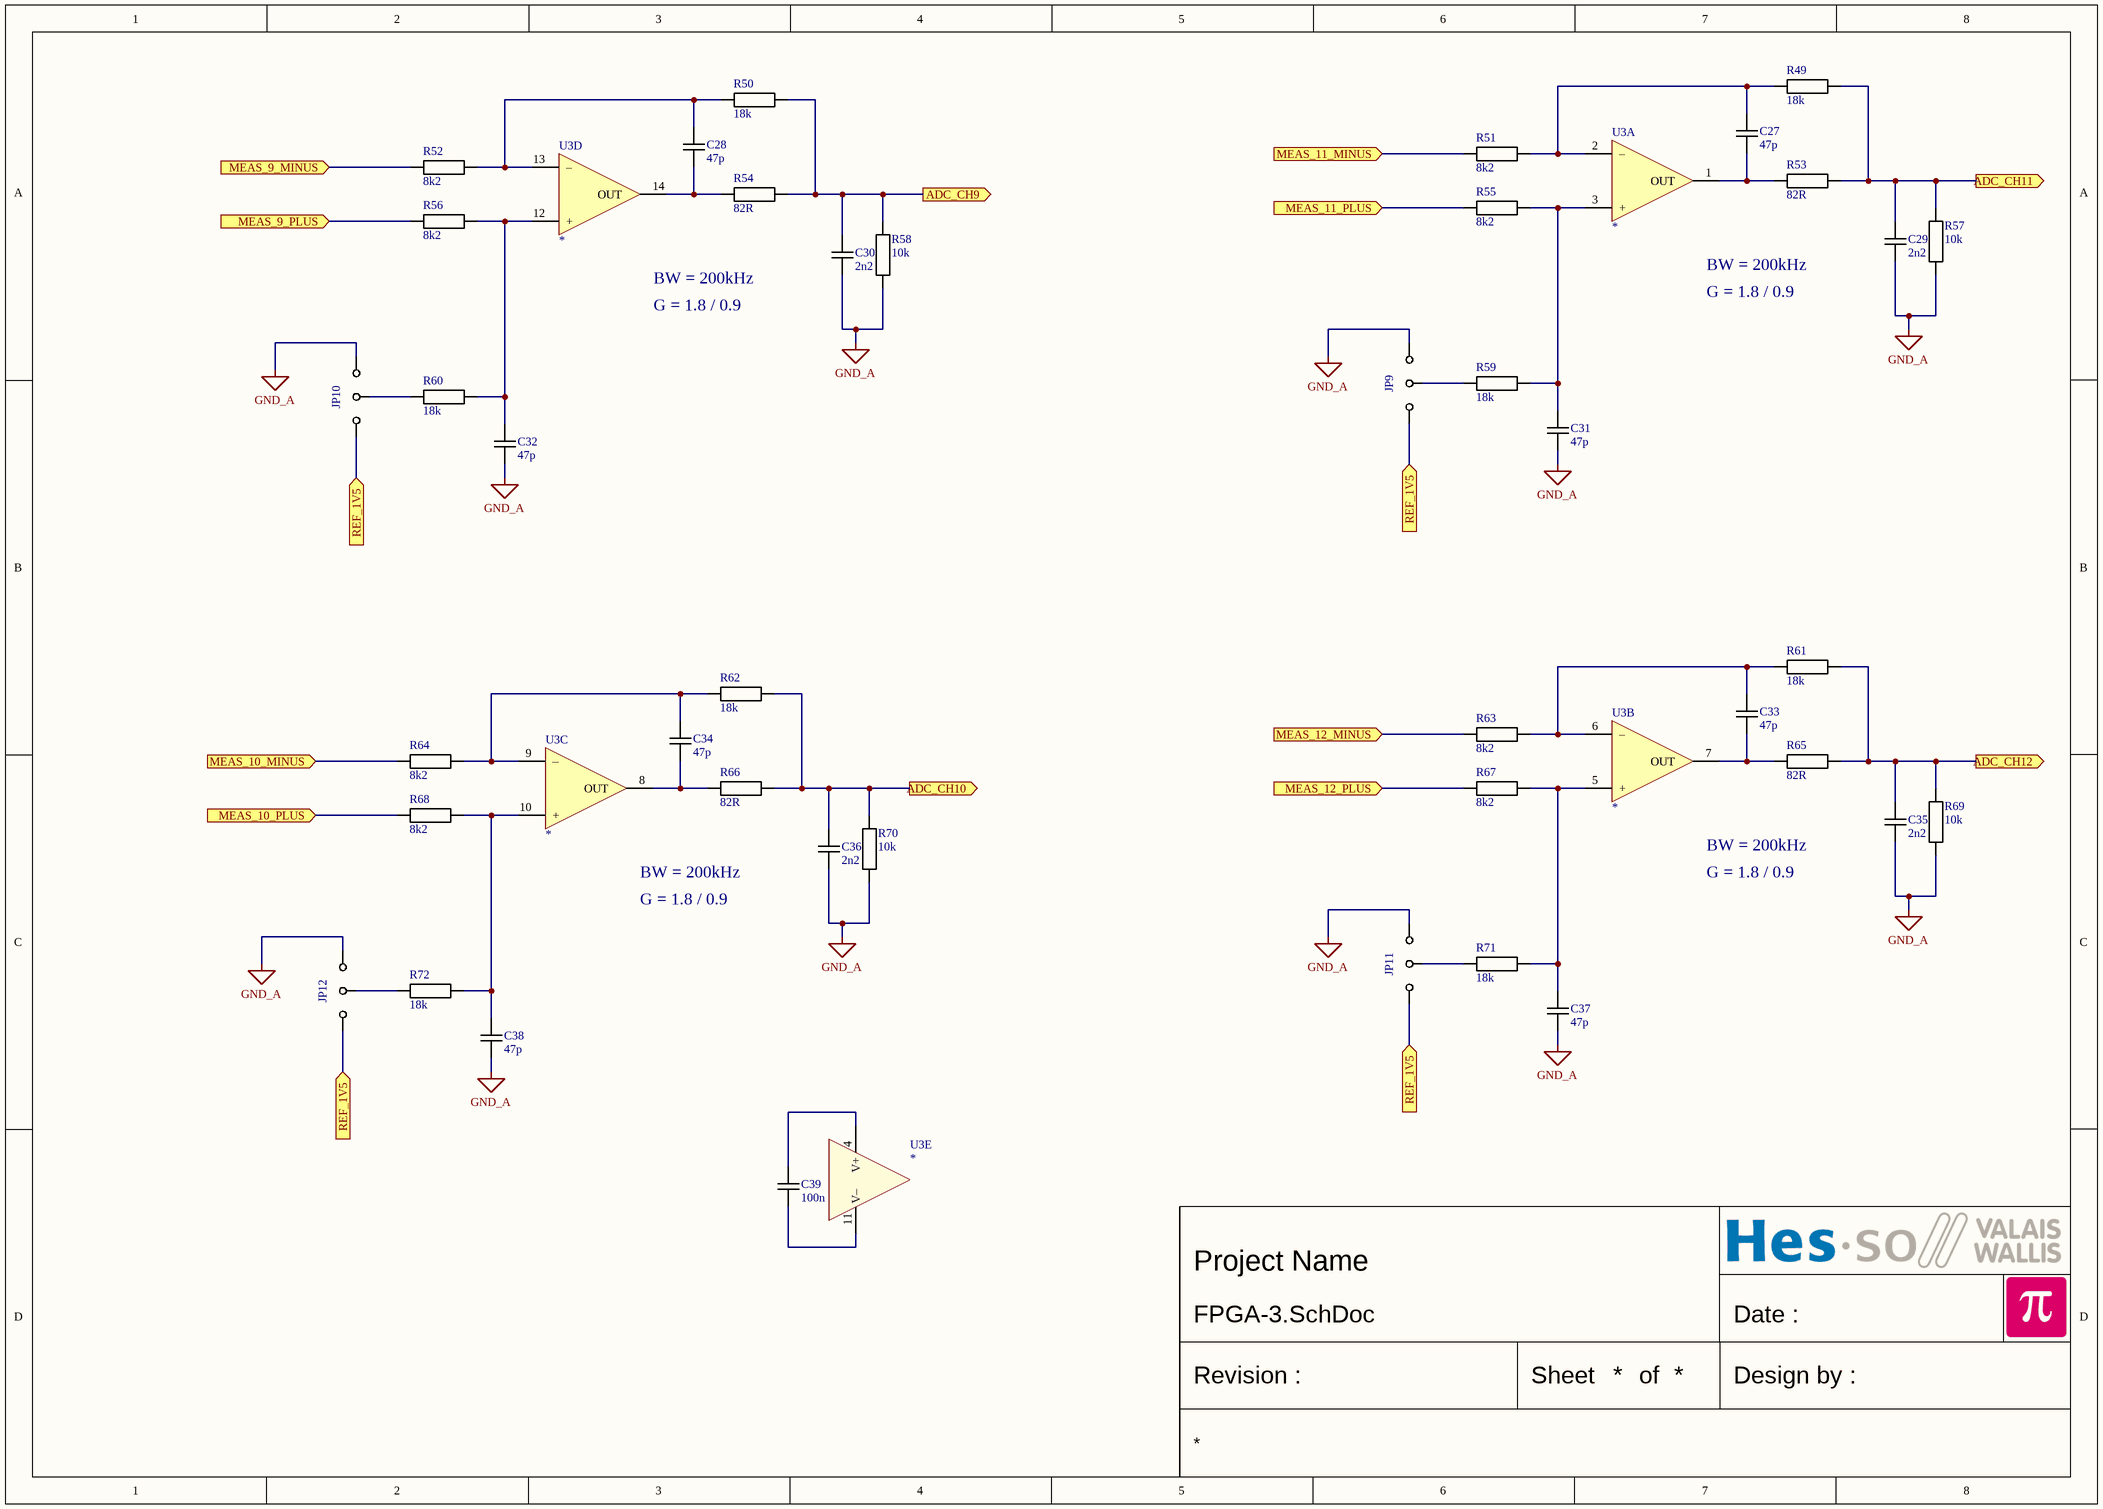
[diagram p5: FPGA-3.SchDoc]

### Parts
C27  47p  [CAPACITOR 1608 REFLOW]
C28  47p  [CAPACITOR 1608 REFLOW]
C29  2n2  [CAPACITOR 1608 REFLOW]
C30  2n2  [CAPACITOR 1608 REFLOW]
C31  47p  [CAPACITOR 1608 REFLOW]
C32  47p  [CAPACITOR 1608 REFLOW]
C33  47p  [CAPACITOR 1608 REFLOW]
C34  47p  [CAPACITOR 1608 REFLOW]
C35  2n2  [CAPACITOR 1608 REFLOW]
C36  2n2  [CAPACITOR 1608 REFLOW]
C37  47p  [CAPACITOR 1608 REFLOW]
C38  47p  [CAPACITOR 1608 REFLOW]
C39  100n  [CAPACITOR 1608 REFLOW]
JP9  {Value}  [JUMPER3 SMD 1608]  (value not drawn)
JP10  {Value}  [JUMPER3 SMD 1608]  (value not drawn)
JP11  {Value}  [JUMPER3 SMD 1608]  (value not drawn)
JP12  {Value}  [JUMPER3 SMD 1608]  (value not drawn)
R49  18k  [RESISTOR 1608 REFLOW]
R50  18k  [RESISTOR 1608 REFLOW]
R51  8k2  [RESISTOR 1608 REFLOW]
R52  8k2  [RESISTOR 1608 REFLOW]
R53  82R  [RESISTOR 1608 REFLOW]
R54  82R  [RESISTOR 1608 REFLOW]
R55  8k2  [RESISTOR 1608 REFLOW]
R56  8k2  [RESISTOR 1608 REFLOW]
R57  10k  [RESISTOR 1608 REFLOW]
R58  10k  [RESISTOR 1608 REFLOW]
R59  18k  [RESISTOR 1608 REFLOW]
R60  18k  [RESISTOR 1608 REFLOW]
R61  18k  [RESISTOR 1608 REFLOW]
R62  18k  [RESISTOR 1608 REFLOW]
R63  8k2  [RESISTOR 1608 REFLOW]
R64  8k2  [RESISTOR 1608 REFLOW]
R65  82R  [RESISTOR 1608 REFLOW]
R66  82R  [RESISTOR 1608 REFLOW]
R67  8k2  [RESISTOR 1608 REFLOW]
R68  8k2  [RESISTOR 1608 REFLOW]
R69  10k  [RESISTOR 1608 REFLOW]
R70  10k  [RESISTOR 1608 REFLOW]
R71  18k  [RESISTOR 1608 REFLOW]
R72  18k  [RESISTOR 1608 REFLOW]
U3  *  [SO14 P1.27 C4.0X8.8 H1.75]  (parts A,B,C,D,E of 5)

### Ports
ADC_CH9 (out), ADC_CH10 (out), ADC_CH11 (out), ADC_CH12 (out), MEAS_9_MINUS (in), MEAS_9_PLUS (in), MEAS_10_MINUS (in), MEAS_10_PLUS (in), MEAS_11_MINUS (in), MEAS_11_PLUS (in), MEAS_12_MINUS (in), MEAS_12_PLUS (in), REF_1V5 (in)

### Nets
GND_A: C29.1 C30.1 C31.1 C32.1 C35.1 C36.1 C37.1 C38.1 JP9.3 JP10.3 JP11.3 JP12.3 R57.2 R58.2 R69.2 R70.2
NetC27_1: C27.1 R53.1 U3.1(OUT)
NetC27_2: C27.2 R49.1 R51.2 U3.2(–)
NetC28_1: C28.1 R54.1 U3.14(OUT)
NetC28_2: C28.2 R50.1 R52.2 U3.13(–)
NetC29_2: C29.2 R49.2 R53.2 R57.1 ; port ADC_CH11
NetC30_2: C30.2 R50.2 R54.2 R58.1 ; port ADC_CH9
NetC31_2: C31.2 R55.2 R59.1 U3.3(+)
NetC32_2: C32.2 R56.2 R60.1 U3.12(+)
NetC33_1: C33.1 R65.1 U3.7(OUT)
NetC33_2: C33.2 R61.1 R63.2 U3.6(–)
NetC34_1: C34.1 R66.1 U3.8(OUT)
NetC34_2: C34.2 R62.1 R64.2 U3.9(–)
NetC35_2: C35.2 R61.2 R65.2 R69.1 ; port ADC_CH12
NetC36_2: C36.2 R62.2 R66.2 R70.1 ; port ADC_CH10
NetC37_2: C37.2 R67.2 R71.1 U3.5(+)
NetC38_2: C38.2 R68.2 R72.1 U3.10(+)
NetC39_1: C39.1 U3.11(V–)
NetC39_2: C39.2 U3.4(V+)
NetC106_2: JP9.1 JP10.1 JP11.1 JP12.1 ; port REF_1V5
NetJP9_2: JP9.2 R59.2
NetJP10_2: JP10.2 R60.2
NetJP11_2: JP11.2 R71.2
NetJP12_2: JP12.2 R72.2
NetR51_1: R51.1 ; port MEAS_11_MINUS
NetR52_1: R52.1 ; port MEAS_9_MINUS
NetR55_1: R55.1 ; port MEAS_11_PLUS
NetR56_1: R56.1 ; port MEAS_9_PLUS
NetR63_1: R63.1 ; port MEAS_12_MINUS
NetR64_1: R64.1 ; port MEAS_10_MINUS
NetR67_1: R67.1 ; port MEAS_12_PLUS
NetR68_1: R68.1 ; port MEAS_10_PLUS

### Notes on the sheet
- BW = 200kHz
- G = 1.8 / 0.9
- Date :
- Revision :
- Sheet
- of
- Design by :

### Library data of the parts
C27-C39 = Capacitor: Capacitor X7R 10% 50V 1608(0603)
  C27 C28 C31-C34 C37 C38: Value: 47p
  C29 C30 C35 C36: Value: 2n2
  C39: Value: 100n
JP9-JP12 = JUMPER 3 POS: Value: {Value}
R49-R72 = Resistor: Resistor 1% 50V 100mW 1608(0603)
  R49 R50 R59-R62 R71 R72: Value: 18k
  R51 R52 R55 R56 R63 R64 R67 R68: Value: 8k2
  R53 R54 R65 R66: Value: 82R
  R57 R58 R69 R70: Value: 10k
U3 = OPA QUAD: Generic quad OPA 14 pins; Value: *

## Sheet FPGA-7.SchDoc
size A3; Date: Date; CompanyName: HESSO; Engineer: Name; Address1: Route du Rawyl 47; Address2: 1950 Sion; Address3: Switzerland; ProjectName: Project Name
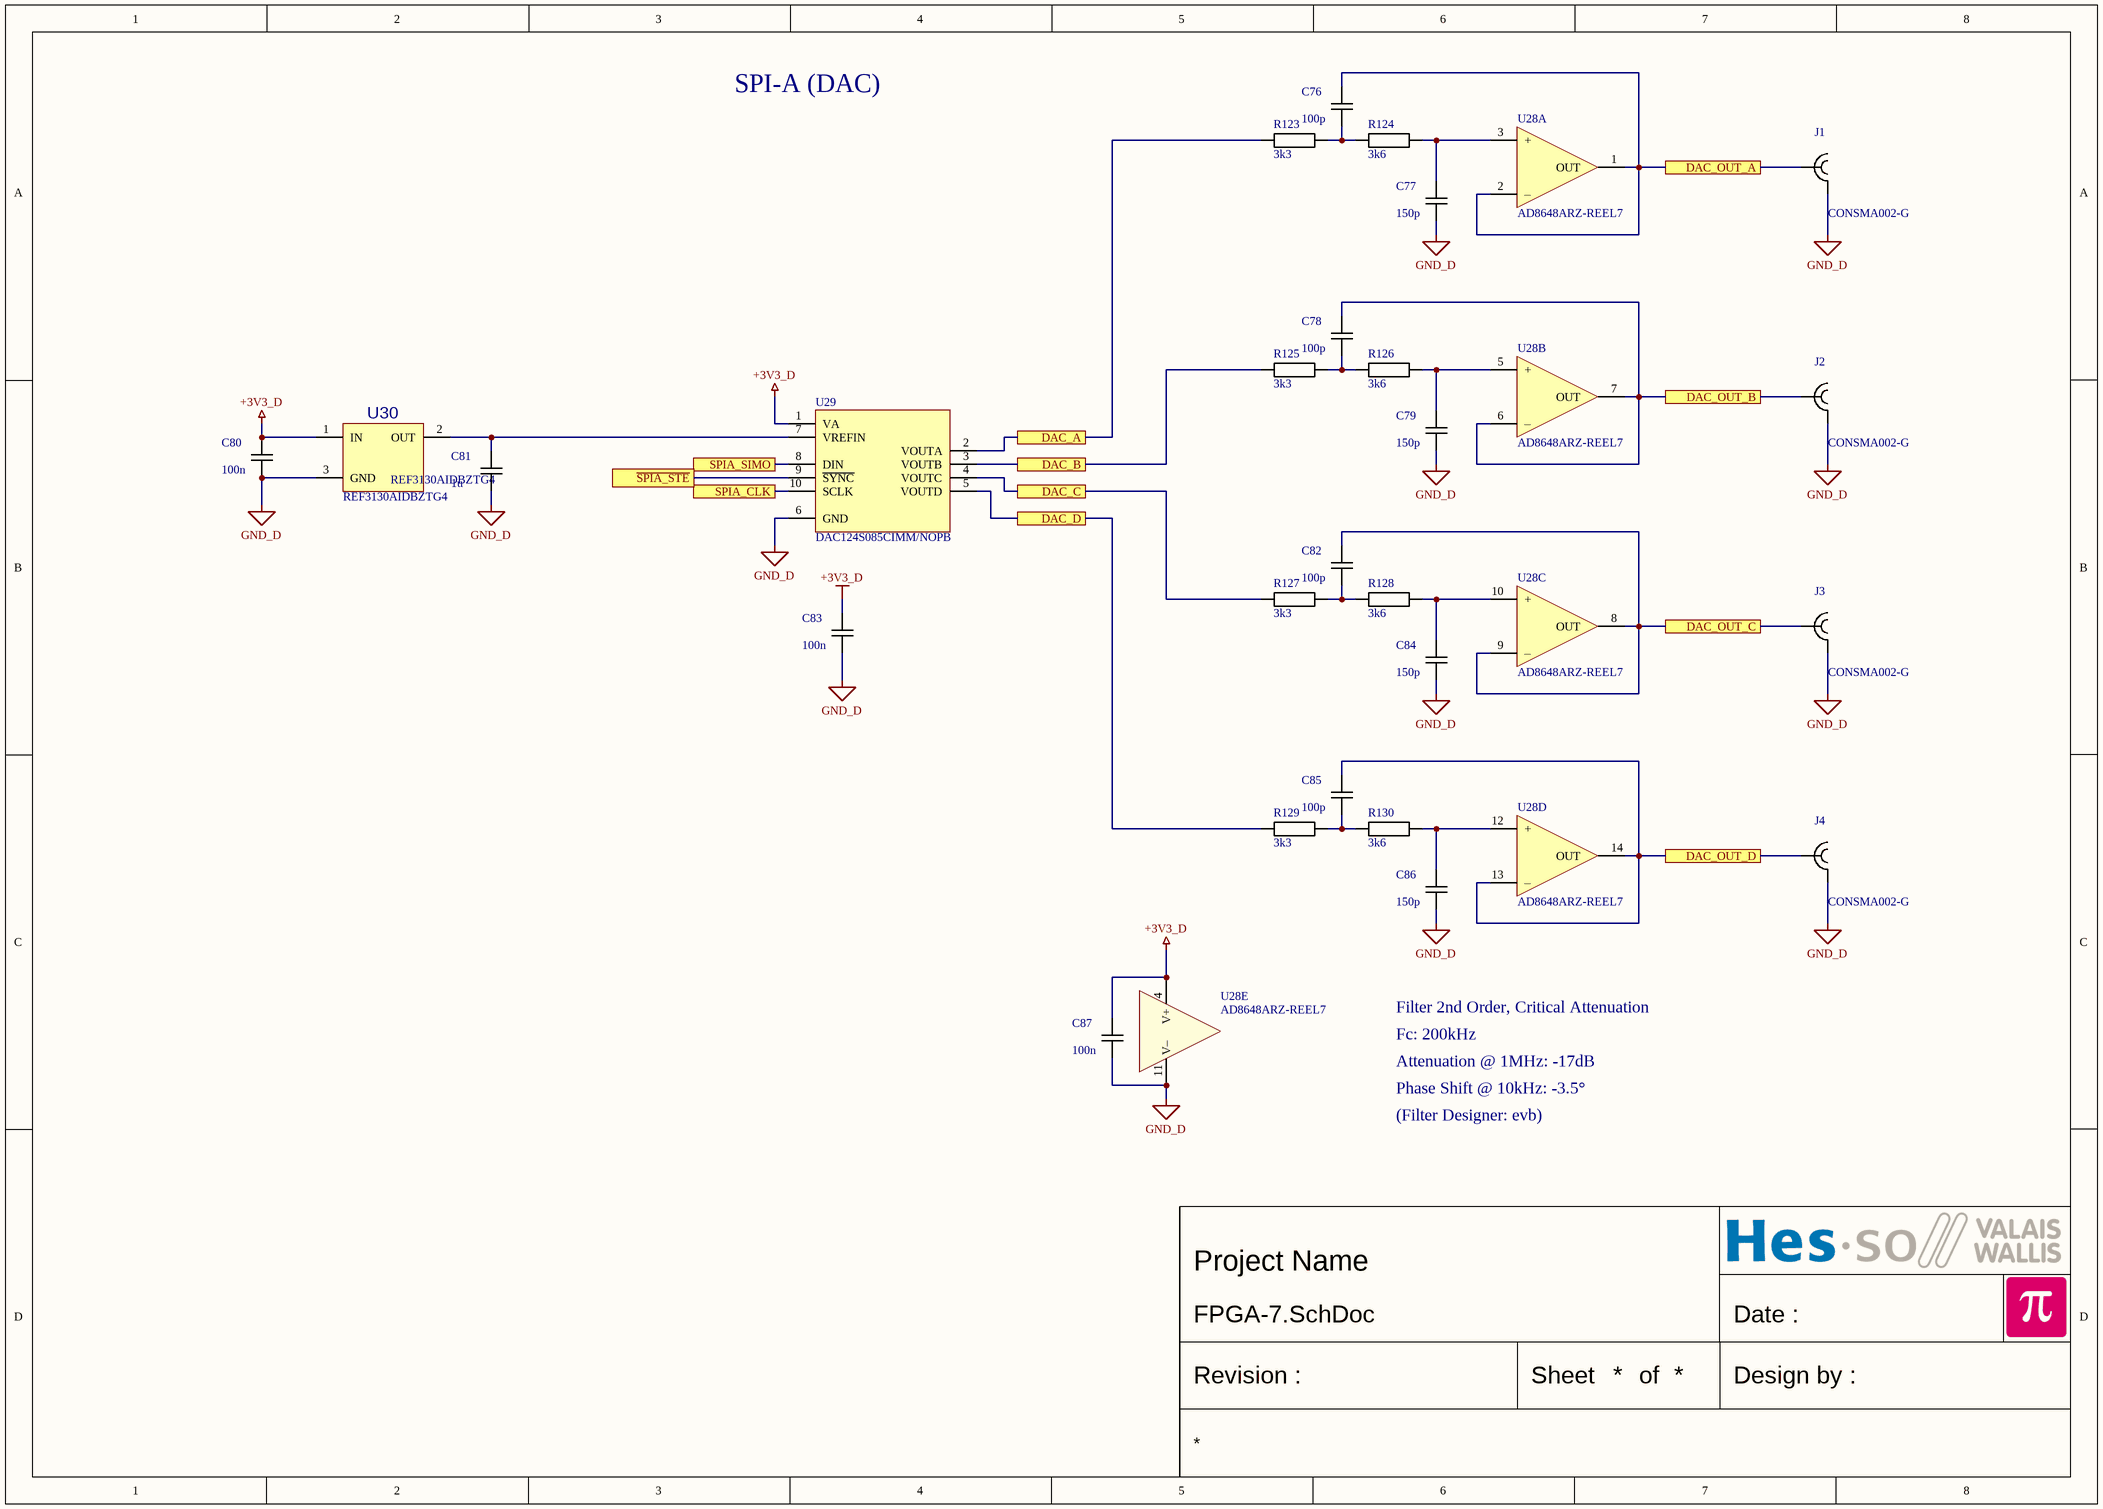
[diagram p6: FPGA-7.SchDoc]

### Parts
C76  100p  [CAPACITOR 2012 REFLOW]
C77  150p  [CAPACITOR 2012 REFLOW]
C78  100p  [CAPACITOR 2012 REFLOW]
C79  150p  [CAPACITOR 2012 REFLOW]
C80  100n  [CAPACITOR 2012 REFLOW]
C81  1u  [CAPACITOR 2012 REFLOW]
C82  100p  [CAPACITOR 2012 REFLOW]
C83  100n  [CAPACITOR 1608 REFLOW]
C84  150p  [CAPACITOR 2012 REFLOW]
C85  100p  [CAPACITOR 2012 REFLOW]
C86  150p  [CAPACITOR 2012 REFLOW]
C87  100n  [CAPACITOR 1608 REFLOW]
J1  CONSMA002-G  [SMA TH Right Angle Linx CONSMA002]
J2  CONSMA002-G  [SMA TH Right Angle Linx CONSMA002]
J3  CONSMA002-G  [SMA TH Right Angle Linx CONSMA002]
J4  CONSMA002-G  [SMA TH Right Angle Linx CONSMA002]
R123  3k3  [RESISTOR 2012 REFLOW]
R124  3k6  [RESISTOR 2012 REFLOW]
R125  3k3  [RESISTOR 2012 REFLOW]
R126  3k6  [RESISTOR 2012 REFLOW]
R127  3k3  [RESISTOR 2012 REFLOW]
R128  3k6  [RESISTOR 2012 REFLOW]
R129  3k3  [RESISTOR 2012 REFLOW]
R130  3k6  [RESISTOR 2012 REFLOW]
U28  AD8648ARZ-REEL7  [SO14 P1.27 C4.0X8.8 H1.75]  (parts A,B,C,D,E of 5)
U29  DAC124S085CIMM/NOPB  [VSSOP10 P0.5 C3.1X3.1 H1.1]
U30  REF3130AIDBZTG4  [SOT23 P0.95 C1.6x3.0 H1.3]

### Ports
DAC_A, DAC_B, DAC_C, DAC_D, DAC_OUT_A, DAC_OUT_B, DAC_OUT_C, DAC_OUT_D, SPIA_CLK, SPIA_SIMO, ~{SPIA_STE}

### Nets
+3V3_D: C80.2 C83.2 C87.2 U28.4(V+) U29.1(VA) U30.1(IN)
GND_D: C77.1 C79.1 C80.1 C81.1 C83.1 C84.1 C86.1 C87.1 J1.2 J2.2 J3.2 J4.2 U28.11(V–) U29.6(GND) U30.3(GND)
NetC76_1: C76.1 R123.2 R124.1
NetC76_2: C76.2 J1.1 U28.1(OUT) U28.2(–) ; port DAC_OUT_A
NetC77_2: C77.2 R124.2 U28.3(+)
NetC78_1: C78.1 R125.2 R126.1
NetC78_2: C78.2 J2.1 U28.6(–) U28.7(OUT) ; port DAC_OUT_B
NetC79_2: C79.2 R126.2 U28.5(+)
NetC81_2: C81.2 U29.7(VREFIN) U30.2(OUT)
NetC82_1: C82.1 R127.2 R128.1
NetC82_2: C82.2 J3.1 U28.8(OUT) U28.9(–) ; port DAC_OUT_C
NetC84_2: C84.2 R128.2 U28.10(+)
NetC85_1: C85.1 R129.2 R130.1
NetC85_2: C85.2 J4.1 U28.13(–) U28.14(OUT) ; port DAC_OUT_D
NetC86_2: C86.2 R130.2 U28.12(+)
NetR123_1: R123.1 U29.2(VOUTA) ; port DAC_A
NetR125_1: R125.1 U29.3(VOUTB) ; port DAC_B
NetR127_1: R127.1 U29.4(VOUTC) ; port DAC_C
NetR129_1: R129.1 U29.5(VOUTD) ; port DAC_D
NetU29_8: U29.8(DIN) ; port SPIA_SIMO
NetU29_9: U29.9(~{SYNC}) ; port ~{SPIA_STE}
NetU29_10: U29.10(SCLK) ; port SPIA_CLK

### Notes on the sheet
- SPI-A (DAC)
- Filter 2nd Order, Critical Attenuation
- Fc: 200kHz
- Attenuation @ 1MHz: -17dB
- Phase Shift @ 10kHz: -3.5°
- (Filter Designer: evb)
- Date :
- Revision :
- Sheet
- of
- Design by :

### Library data of the parts
C76-C80 C82 C84-C86 = Capacitor: Capacitor X7R 10% 50V 2012(0805)
  C76 C78 C82 C85: Value: 100p
  C77 C79 C84 C86: Value: 150p
  C80: Value: 100n
C81 = Capacitor: Capacitor X7R 10% 10V 2012(0805); Value: 1u
C83 C87 = Capacitor: Capacitor X7R 10% 50V 1608(0603); Value: 100n
J1-J4 = SMA TH RIGHT ANGLE LINX CONSMA002: Manufacturer: Linx Technologies; Value: CONSMA002-G; Mouser No.: 712-CONSMA002-G
R123-R130 = Resistor: Resistor 1% 50V 125mW 2012(0805)
  R123 R125 R127 R129: Value: 3k3
  R124 R126 R128 R130: Value: 3k6
U28 = OPA QUAD: as U31 on sheet FPGA-8; Value: AD8648ARZ-REEL7; Mouser No.: 584-AD8648ARZ-R7
U29 = DAC124S085CIMM: as U32 on sheet FPGA-8; Value: DAC124S085CIMM/NOPB; Mouser No.: 926-DAC124S085CIMMNO
U30 = REFERENCE SOT23 IN-OUT- GND: as U33 on sheet FPGA-8; Value: REF3130AIDBZTG4; Mouser No.: 595-REF3130AIDBZTG4

## Sheet FPGA-Supply.SchDoc
size A2; Date: Date; CompanyName: HESSO; Engineer: Name; Address1: Route du Rawyl 47; Address2: 1950 Sion; Address3: Switzerland; ProjectName: Project Name
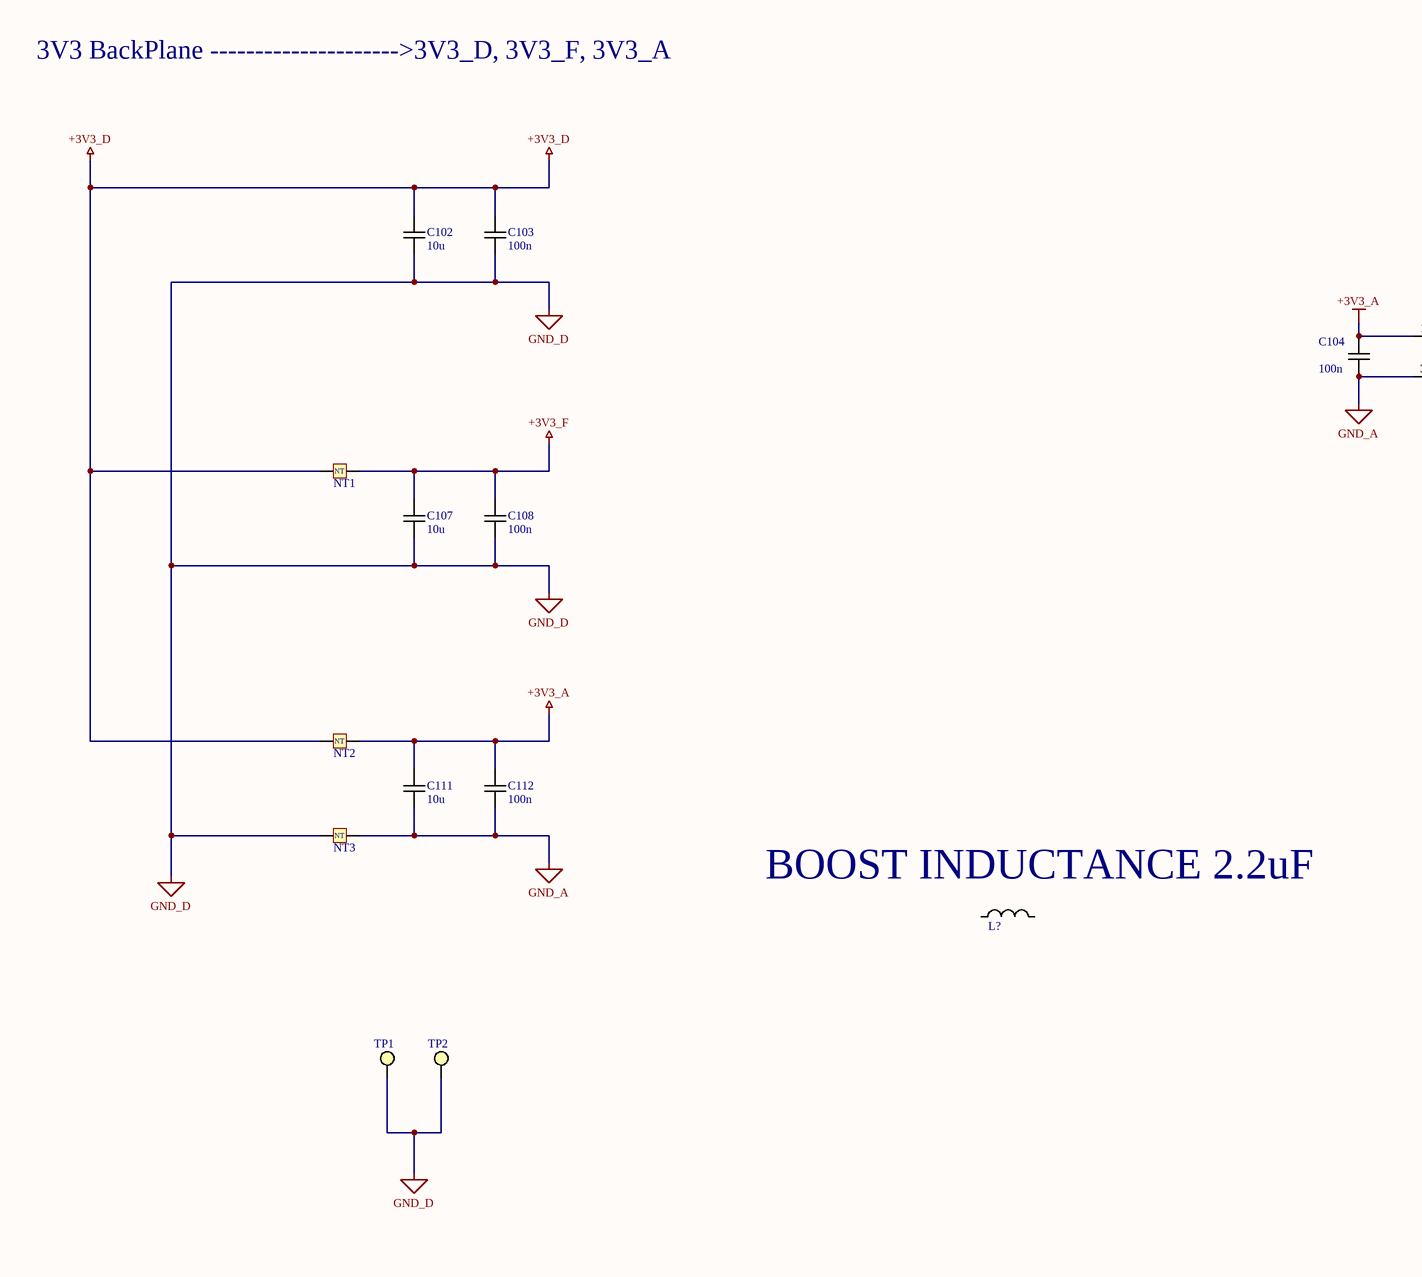
[diagram p7: FPGA-Supply.SchDoc, left]
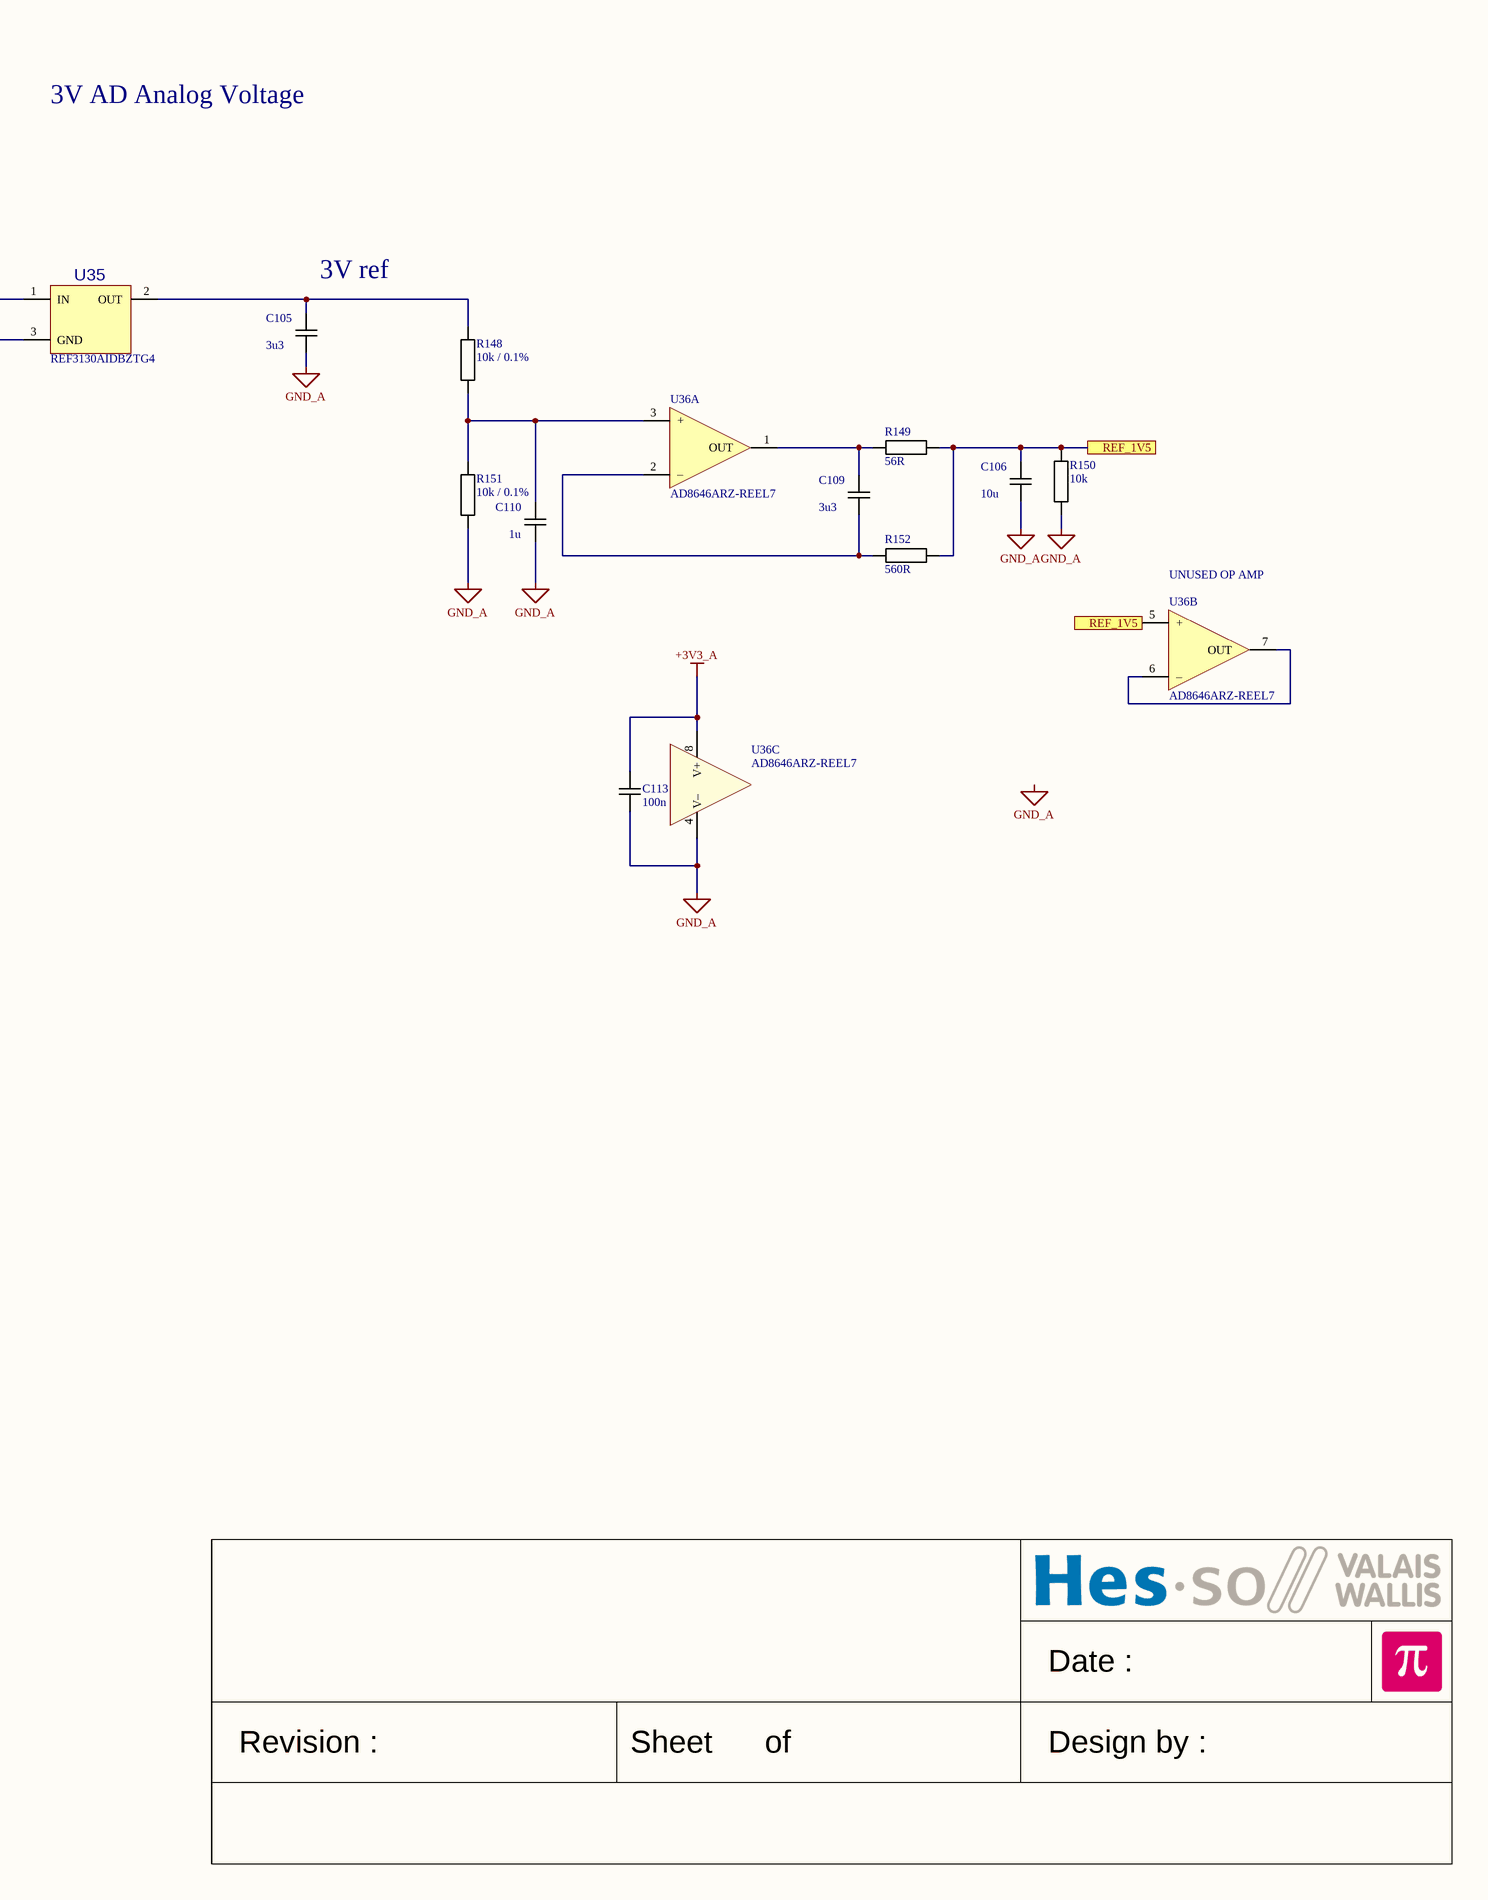
[diagram p8: FPGA-Supply.SchDoc, right]

### Parts
C102  10u  [CAPACITOR 2012 REFLOW]
C103  100n  [CAPACITOR 2012 REFLOW]
C104  100n  [CAPACITOR 1608 REFLOW]
C105  3u3  [CAPACITOR 2012 REFLOW]
C106  10u  [CAPACITOR 2012 REFLOW]
C107  10u  [CAPACITOR 2012 REFLOW]
C108  100n  [CAPACITOR 2012 REFLOW]
C109  3u3  [CAPACITOR 2012 REFLOW]
C110  1u  [CAPACITOR 2012 REFLOW]
C111  10u  [CAPACITOR 2012 REFLOW]
C112  100n  [CAPACITOR 2012 REFLOW]
C113  100n  [CAPACITOR 1608 REFLOW]
L?  NRS5020T2R2NMGJ  [TDK VLCF5020-1]  (value not drawn)
NT1  Net Tie  [NET TIE 1005]  (value not drawn)  (net tie, no BOM)
NT2  Net Tie  [NET TIE 1005]  (value not drawn)  (net tie, no BOM)
NT3  Net Tie  [NET TIE 1005]  (value not drawn)  (net tie, no BOM)
R148  10k / 0.1%  [RESISTOR 1608 REFLOW]
R149  56R  [RESISTOR 1608 REFLOW]
R150  10k  [RESISTOR 1608 REFLOW]
R151  10k / 0.1%  [RESISTOR 1608 REFLOW]
R152  560R  [RESISTOR 1608 REFLOW]
TP1  *  [Test Point Keystone Miniature BLACK]  (value not drawn)
TP2  *  [Test Point Keystone Miniature BLACK]  (value not drawn)
U35  REF3130AIDBZTG4  [SOT23 P0.95 C1.6x3.0 H1.3]
U36  AD8646ARZ-REEL7  [SO8 P1.27 C4.0X5.0 H1.75]  (parts A,B,C of 3)

### Ports
REF_1V5

### Nets
+3V3_A: C104.2 C111.1 C112.1 C113.2 NT2.2 U35.1(IN) U36.8(V+)
+3V3_D: C102.1 C103.1 NT1.1 NT2.1
+3V3_F: C107.1 C108.1 NT1.2
GND_A: C104.1 C105.1 C106.1 C110.1 C111.2 C112.2 C113.1 NT3.2 R150.2 R151.2 U35.3(GND) U36.4(V–)
GND_D: C102.2 C103.2 C107.2 C108.2 NT3.1 TP1.1 TP2.1
NetC105_2: C105.2 R148.2 U35.2(OUT)
NetC106_2: C106.2 R149.1 R150.1 R152.1 U36.5(+) ; port REF_1V5
NetC109_1: C109.1 R152.2 U36.2(–)
NetC109_2: C109.2 R149.2 U36.1(OUT)
NetC110_2: C110.2 R148.1 R151.1 U36.3(+)
NetU36_6: U36.6(–) U36.7(OUT)

Not connected (* = marked no-connect by the designer): L? 1 2

### Notes on the sheet
- 3V3 BackPlane --------------------->3V3_D, 3V3_F, 3V3_A
- 3V AD Analog Voltage
- (near C105) 3V ref
- (near U36) UNUSED OP AMP
- (near L?) BOOST INDUCTANCE 2.2uF
- Date :
- Revision :
- Sheet
- of
- Design by :
- Labels drawn without touching a wire or pin: GND_A
- (in symbol Net Tie) NT

### Library data of the parts
C102 C105-C107 C109-C111 = Capacitor: Capacitor X7R 10% 10V 2012(0805)
  C102 C106 C107 C111: Value: 10u
  C105 C109: Value: 3u3
  C110: Value: 1u
C103 C108 C112 = Capacitor: Capacitor X7R 10% 50V 2012(0805); Value: 100n
C104 C113 = Capacitor: Capacitor X7R 10% 50V 1608(0603); Value: 100n
L? = Inductor: Value: NRS5020T2R2NMGJ
NT1-NT3 = Net Tie: Connection for 2 different NETNAME
R148-R152 = Resistor: Resistor 1% 50V 100mW 1608(0603)
  R148 R151: Value: 10k / 0.1%
  R149: Value: 56R
  R150: Value: 10k
  R152: Value: 560R
TP1 TP2 = Test Point: Value: *
U35 = REFERENCE SOT23 IN-OUT- GND: as U33 on sheet FPGA-8; Value: REF3130AIDBZTG4; Mouser No.: 595-REF3130AIDBZTG4
U36 = OPA DUAL: Generic dual OPA 8 pins; Manufacturer: Analog Devices; Value: AD8646ARZ-REEL7; Mouser No.: 584-AD8646ARZ-R7

## Nets that join several sheets
+3V3_D: FPGA (68 pins), FPGA-8 (6 pins), FPGA-7 (6 pins), FPGA-Supply (C102.1 C103.1 NT1.1 NT2.1)
GND_A: FPGA-1 (16 pins), FPGA-2 (16 pins), FPGA-3 (16 pins), FPGA-Supply (12 pins)
GND_D: FPGA (71 pins), FPGA-8 (15 pins), FPGA-7 (15 pins), FPGA-Supply (7 pins)
NetC76_2: FPGA-8 (C88.2 J5.1 U31.1 U31.2), FPGA-7 (C76.2 J1.1 U28.1 U28.2)
NetC78_2: FPGA-8 (C90.2 J6.1 U31.6 U31.7), FPGA-7 (C78.2 J2.1 U28.6 U28.7)
NetC82_2: FPGA-8 (C94.2 J7.1 U31.8 U31.9), FPGA-7 (C82.2 J3.1 U28.8 U28.9)
NetC85_2: FPGA-8 (C97.2 J8.1 U31.13 U31.14), FPGA-7 (C85.2 J4.1 U28.13 U28.14)
NetC106_2: FPGA-1 (JP1.1 JP2.1 JP3.1 JP4.1), FPGA-2 (JP5.1 JP6.1 JP7.1 JP8.1), FPGA-3 (JP9.1 JP10.1 JP11.1 JP12.1), FPGA-Supply (5 pins)
NetR123_1: FPGA-8 (R131.1 U32.2), FPGA-7 (R123.1 U29.2)
NetR125_1: FPGA-8 (R133.1 U32.3), FPGA-7 (R125.1 U29.3)
NetR127_1: FPGA-8 (R135.1 U32.4), FPGA-7 (R127.1 U29.4)
NetR129_1: FPGA-8 (R137.1 U32.5), FPGA-7 (R129.1 U29.5)
NetU29_8: FPGA-8 (U32.8), FPGA-7 (U29.8)
NetU29_9: FPGA-8 (U32.9), FPGA-7 (U29.9)
NetU29_10: FPGA-8 (U32.10), FPGA-7 (U29.10)